# Altium project KitKTS.PrjPcb (part 1 of 3)
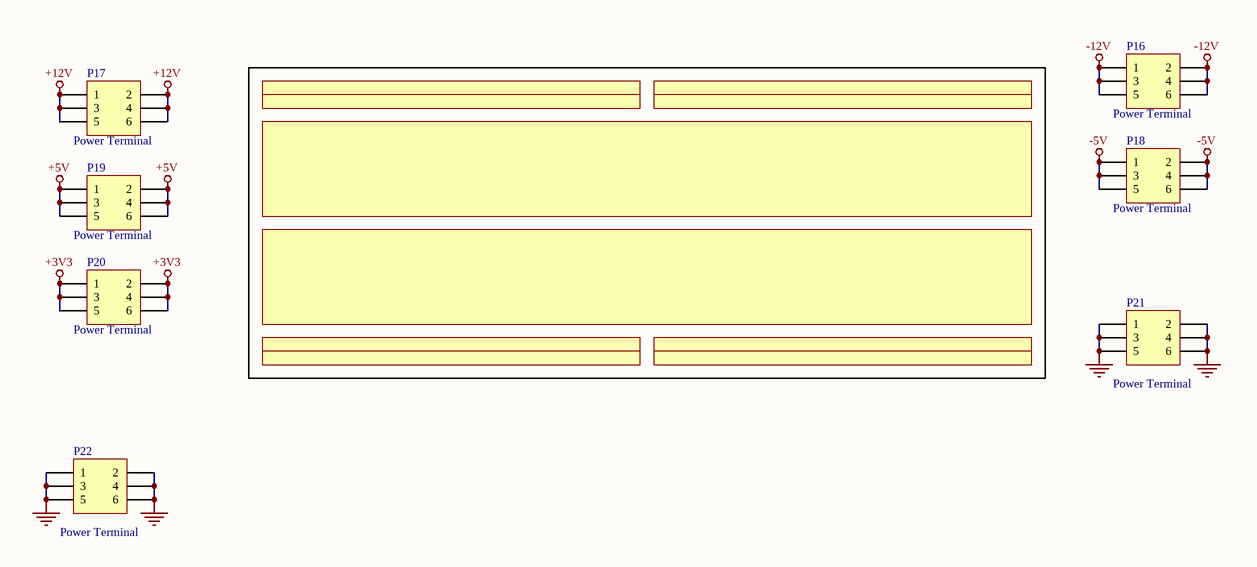
[diagram p0: 01-Breadboard.SchDoc]
26 sheets, 688 parts. Net scope: global (net labels, ports and power ports of the same name join across sheets).
Board file: mach PCB.PcbDoc
Sheets:
  01-Breadboard.SchDoc
  02-PowerSupply.SchDoc
  03-PulseGenerator.SchDoc
  04-LogicAND.SchDoc
  04-ANDStatusLed.SchDoc
  05-LogicOR.SchDoc
  05-ORStatusLed.SchDoc
  06-LogicNOT.SchDoc
  06-NOTStatusLed.SchDoc
  07-LogicXOR.SchDoc
  07-XORStatusLed.SchDoc
  08-LogicNAND.SchDoc
  08-NANDStatusLed.SchDoc
  09-LogicNOR.SchDoc
  09-NORStatusLed.SchDoc
  10-Buffer.SchDoc
  11-DFlipFlop.SchDoc
  12-JKFlipFlop.SchDoc
  13-Counter74LS90.SchDoc
  14-Counter74LS192.SchDoc
  15-DistanceSRF05.SchDoc
  16-BitSW.SchDoc
  16-BitSWStatusLed.SchDoc
  17-Led.SchDoc
  18-Led7.SchDoc
  19-CPLD.SchDoc

## Sheet 01-Breadboard.SchDoc
size A4

### Parts
P16  value Power Terminal  [HDR2X3]  (hidden comment: Header 3X2)
P17  value Power Terminal  [HDR2X3]  (hidden comment: Header 3X2)
P18  value Power Terminal  [HDR2X3]  (hidden comment: Header 3X2)
P19  value Power Terminal  [HDR2X3]  (hidden comment: Header 3X2)
P20  value Power Terminal  [HDR2X3]  (hidden comment: Header 3X2)
P21  value Power Terminal  [HDR2X3]  (hidden comment: Header 3X2)
P22  value Power Terminal  [HDR2X3]  (hidden comment: Header 3X2)

### Nets
+3V3: P20.1 P20.2 P20.3 P20.4 P20.5 P20.6
+5V: P19.1 P19.2 P19.3 P19.4 P19.5 P19.6
+12V: P17.1 P17.2 P17.3 P17.4 P17.5 P17.6
-5V: P18.1 P18.2 P18.3 P18.4 P18.5 P18.6
-12V: P16.1 P16.2 P16.3 P16.4 P16.5 P16.6
GND: P21.1 P21.2 P21.3 P21.4 P21.5 P21.6 P22.1 P22.2 P22.3 P22.4 P22.5 P22.6

### Library data of the parts
P16-P22 = Header 3X2: Header, 3-Pin, Dual row; LatestRevisionDate: 17-Jul-2002; LatestRevisionNote: Re-released for DXP Platform.

## Sheet 02-PowerSupply.SchDoc
size A4
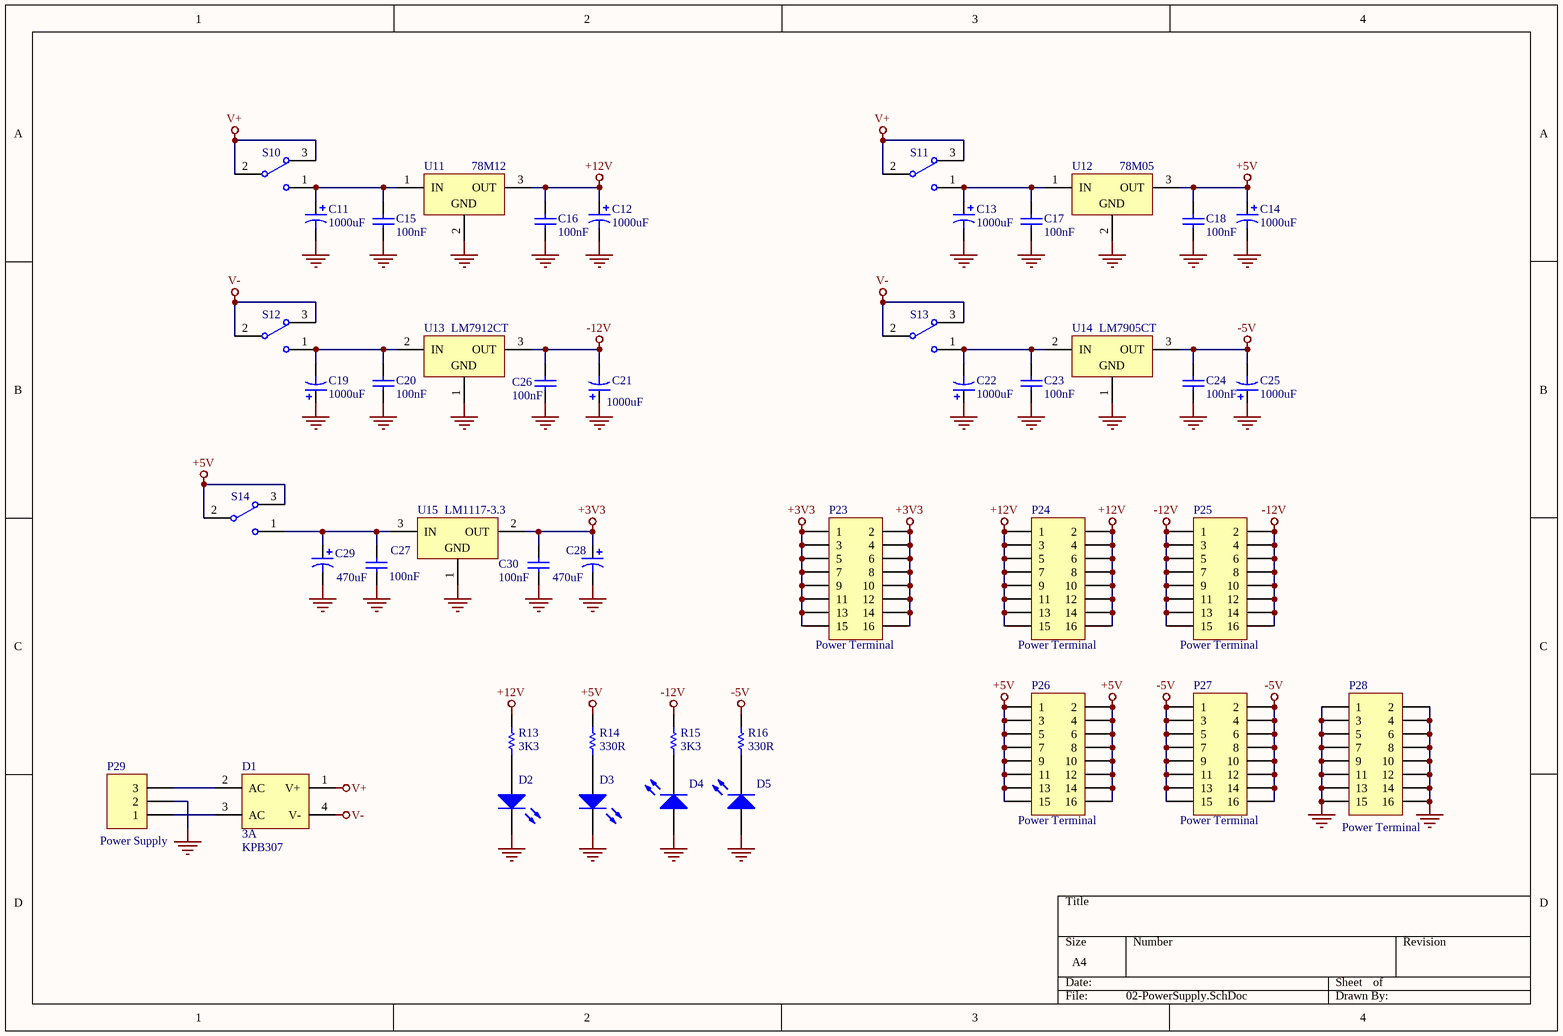
[diagram p1: 02-PowerSupply.SchDoc]

### Parts
C11  value 1000uF  [C-ALU-10x10mm]  (hidden comment: 1000uF/25V)
C12  value 1000uF  [C-ALU-10x10mm]  (hidden comment: 1000uF/25V)
C13  value 1000uF  [C-ALU-10x10mm]  (hidden comment: 1000uF/25V)
C14  value 1000uF  [C-ALU-10x10mm]  (hidden comment: 1000uF/25V)
C15  value 100nF  [C-0805]  (hidden comment: 104)
C16  value 100nF  [C-0805]  (hidden comment: 104)
C17  value 100nF  [C-0805]  (hidden comment: 104)
C18  value 100nF  [C-0805]  (hidden comment: 104)
C19  value 1000uF  [C-ALU-10x10mm]  (hidden comment: 1000uF/25V)
C20  value 100nF  [C-0805]  (hidden comment: 104)
C21  value 1000uF  [C-ALU-10x10mm]  (hidden comment: 1000uF/25V)
C22  value 1000uF  [C-ALU-10x10mm]  (hidden comment: 1000uF/25V)
C23  value 100nF  [C-0805]  (hidden comment: 104)
C24  value 100nF  [C-0805]  (hidden comment: 104)
C25  value 1000uF  [C-ALU-10x10mm]  (hidden comment: 1000uF/25V)
C26  value 100nF  [C-0805]  (hidden comment: 104)
C27  value 100nF  [C-0805]  (hidden comment: 104)
C28  value 470uF  [C-ALU-10x10mm]  (hidden comment: 470uF/16V)
C29  value 470uF  [C-ALU-10x10mm]  (hidden comment: 470uF/16V)
C30  value 100nF  [C-0805]  (hidden comment: 104)
D1  KPB307  value 3A  [D-DB-3A]
D2  LED  [LED-3528]  (value not drawn)
D3  LED  [LED-3528]  (value not drawn)
D4  LED  [LED-3528]  (value not drawn)
D5  LED  [LED-3528]  (value not drawn)
P23  value Power Terminal  [HDR2X8]  (hidden comment: Header 8X2)
P24  value Power Terminal  [HDR2X8]  (hidden comment: Header 8X2)
P25  value Power Terminal  [HDR2X8]  (hidden comment: Header 8X2)
P26  value Power Terminal  [HDR2X8]  (hidden comment: Header 8X2)
P27  value Power Terminal  [HDR2X8]  (hidden comment: Header 8X2)
P28  value Power Terminal  [HDR2X8]  (hidden comment: Header 8X2)
P29  value Power Supply  [HDR1X3]  (hidden comment: H3)
R13  value 3K3  [C-0805]  (hidden comment: 332)
R14  value 330R  [R-0805]  (hidden comment: 331)
R15  value 3K3  [R-0805]  (hidden comment: 332)
R16  value 330R  [R-0805]  (hidden comment: 331)
S10  SW-SPDT  [SW-DIP1SMD]  (value not drawn)
S11  SW-SPDT  [SW-DIP1SMD]  (value not drawn)
S12  SW-SPDT  [SW-DIP1SMD]  (value not drawn)
S13  SW-SPDT  [SW-DIP1SMD]  (value not drawn)
S14  SW-SPDT  [SW-DIP1SMD]  (value not drawn)
U11  78M12  [TO-220-2PC]
U12  78M05  [TO-220-2PC]
U13  LM7912CT  [TO-220-2PC]
U14  LM7905CT  [TO-220-2PC]
U15  LM1117-3.3  [TO-220-2PC]

### Nets
+3V3: C28.1 C30.2 P23.1 P23.2 P23.3 P23.4 P23.5 P23.6 P23.7 P23.8 P23.9 P23.10 P23.11 P23.12 P23.13 P23.14 P23.15 P23.16 U15.2(OUT)
+5V: C14.1 C18.2 P26.1 P26.2 P26.3 P26.4 P26.5 P26.6 P26.7 P26.8 P26.9 P26.10 P26.11 P26.12 P26.13 P26.14 P26.15 P26.16 R14.1 S14.2 S14.3 U12.3(OUT)
+12V: C12.1 C16.2 P24.1 P24.2 P24.3 P24.4 P24.5 P24.6 P24.7 P24.8 P24.9 P24.10 P24.11 P24.12 P24.13 P24.14 P24.15 P24.16 R13.1 U11.3(OUT)
-5V: C24.2 C25.2 P27.1 P27.2 P27.3 P27.4 P27.5 P27.6 P27.7 P27.8 P27.9 P27.10 P27.11 P27.12 P27.13 P27.14 P27.15 P27.16 R16.1 U14.3(OUT)
-12V: C21.2 C26.2 P25.1 P25.2 P25.3 P25.4 P25.5 P25.6 P25.7 P25.8 P25.9 P25.10 P25.11 P25.12 P25.13 P25.14 P25.15 P25.16 R15.1 U13.3(OUT)
GND: C11.2 C12.2 C13.2 C14.2 C15.1 C16.1 C17.1 C18.1 C19.1 C20.1 C21.1 C22.1 C23.1 C24.1 C25.1 C26.1 C27.1 C28.2 C29.2 C30.1 D2.2(K) D3.2(K) D4.1(A) D5.1(A) P28.1 P28.2 P28.3 P28.4 P28.5 P28.6 P28.7 P28.8 P28.9 P28.10 P28.11 P28.12 P28.13 P28.14 P28.15 P28.16 P29.2 U11.2(GND) U12.2(GND) U13.1(GND) U14.1(GND) U15.1(GND)
V+: D1.1(V+) S10.2 S10.3 S11.2 S11.3
V-: D1.4(V-) S12.2 S12.3 S13.2 S13.3
NetC11_1: C11.1 C15.2 S10.1 U11.1(IN)
NetC13_1: C13.1 C17.2 S11.1 U12.1(IN)
NetC19_2: C19.2 C20.2 S12.1 U13.2(IN)
NetC22_2: C22.2 C23.2 S13.1 U14.2(IN)
NetC27_2: C27.2 C29.1 S14.1 U15.3(IN)
NetD1_2: D1.2(AC) P29.3
NetD1_3: D1.3(AC) P29.1
NetD2_1: D2.1(A) R13.2
NetD3_1: D3.1(A) R14.2
NetD4_2: D4.2(K) R15.2
NetD5_2: D5.2(K) R16.2

### Library data of the parts
C11-C14 C19 C21 C22 C25 C28 C29 = Cap Pol1: Polarized Capacitor (Radial); Published: 8-Jun-2000; LatestRevisionDate: 17-Jul-2002; LatestRevisionNote: Re-released for DXP Platform.; PackageReference: RB7.6-15; Publisher: Altium Limited
C15-C18 C20 C23 C24 C26 C27 C30 = Cap: Capacitor; Manufacturer: Generic Components; Class: Passive; Published: 08/06/2000; Publisher: Altium Hobart Technology Centre; SubClass: Capacitor
D1 = Bridge2: Diode Bridge; Published: 24-Mar-1999; LatestRevisionDate: 17-Jul-2002; LatestRevisionNote: Re-released for DXP Platform.; PackageReference: D-46_6A
D2-D5 = LED0: Typical INFRARED GaAs LED; Published: 8-Jun-2000; LatestRevisionDate: 08-Jul-2005; LatestRevisionNote: Mech Layer 1 removed.; PackageReference: LED-0; Publisher: Altium Limited; Value: LED
P23-P28 = Header 8X2: Header, 8-Pin, Dual row; LatestRevisionDate: 17-Jul-2002; LatestRevisionNote: Re-released for DXP Platform.
P29 = Header 3: Header, 3-Pin; LatestRevisionDate: 17-Jul-2002; LatestRevisionNote: Re-released for DXP Platform.
R13-R16 = Res1: Resistor; Published: 8-Jun-2000; LatestRevisionDate: 17-Jul-2002; LatestRevisionNote: Re-released for DXP Platform.; PackageReference: AXIAL-0.3; Publisher: Altium Limited
S10-S14 = SW-SPDT: SPDT Subminiature Toggle Switch, Right Angle Mounting, Vertical Actuation; Published: 24-Mar-1999; LatestRevisionDate: 17-Dec-2003; LatestRevisionNote: Schematic revised, PCB Footprint replaced.; DatasheetVersion: 05-Dec-2000; PackageReference: TL36WW15050; Publisher: Altium Limited; PackageDescription: Switch; 4 Leads; ComponentLink1Description: Manufacturer Link; ComponentLink1URL: http://www.apem.com
U11 U12 = LM78M05CT: 3-Terminal Positive Voltage Regulators, 3-pin TO-220; Manufacturer: National Semiconductor; PackageTopMarking: NSUZXYTTE#*LM341T-5.0*LM78M05CT; PowerWise: N; CompType: LDO IC; Published: 4-Dec-2008; DatasheetVersion: Aug-2005; PackageVersion: revL, Jan-1992; PackageReference: T03B; Publisher: Altium Limited; PackageDescription: TO-220, Molded, 3 Lead, Straight; Supplier 1: Farnell; PartNumber: LM78M05CT; RoHS: N; PinCount: 3; ComponentLink1Description: LM78M05 Datasheet; ComponentLink1URL: http://www.national.com/ds/LM/LM78M05.pdf; ComponentLink2Description: LM78M05 Web Page; ComponentLink2URL: http://www.national.com/pf/LM/LM78M05.html; ComponentLink3Description: T03B Package Page; ComponentLink3URL: http://www.national.com/packaging/folders/t03b.html
  U11: Value: 78M12
  U12: Value: 78M05
U13 U14 = LM79M12CT: 3-Terminal Negative Regulators, 3-pin TO-220; Manufacturer: National Semiconductor; PackageTopMarking: NSUZXYTTE#*LM79M*12CT; PowerWise: N; CompType: LDO IC; Published: 4-Dec-2008; DatasheetVersion: Sep-2001; PackageVersion: revL, Jan-1992; PackageReference: T03B; Publisher: Altium Limited; PackageDescription: TO-220, Molded, 3 Lead, Straight; Supplier 1: Farnell; PartNumber: LM79M12CT; RoHS: N; PinCount: 3; ComponentLink1Description: LM79M12 Datasheet; ComponentLink1URL: http://www.national.com/ds/LM/LM79M12.pdf; ComponentLink2Description: LM79M12 Web Page; ComponentLink2URL: http://www.national.com/pf/LM/LM79M12.html; ComponentLink3Description: T03B Package Page; ComponentLink3URL: http://www.national.com/packaging/folders/t03b.html
  U13: Value: LM7912CT
  U14: Value: LM7905CT
U15 = LM1117IDTX-3.3: 800mA Low-Dropout Linear Regulator, 3-pin TO-252; Manufacturer: National Semiconductor; PackageTopMarking: NSUZXYTT*LM1117*IDT-3.3; PowerWise: N; CompType: LDO IC; Published: 1-Mar-2010; DatasheetVersion: Apr-2006; PackageVersion: revD, Feb-2009; PackageReference: TD03B; Publisher: Altium Limited; PackageDescription: TO252, Molded, Jedec, 6.8 x 6.10 x 2.30mm Body, 3 Lead, 2.28mm Pitch, Surface Mount; PartNumber: LM1117IDTX-3.3; Value: LM1117-3.3; PinCount: 3; Code_JEDEC: TO-252-AA; ComponentLink1Description: LM1117 Datasheet; ComponentLink1URL: http://www.national.com/ds/LM/LM1117.pdf; ComponentLink2Description: LM1117 Web Page; ComponentLink2URL: http://www.national.com/pf/LM/LM1117.html; ComponentLink3Description: TD03B Package Page; ComponentLink3URL: http://www.national.com/packaging/folders/td03b.html

## Sheet 03-PulseGenerator.SchDoc
size A4
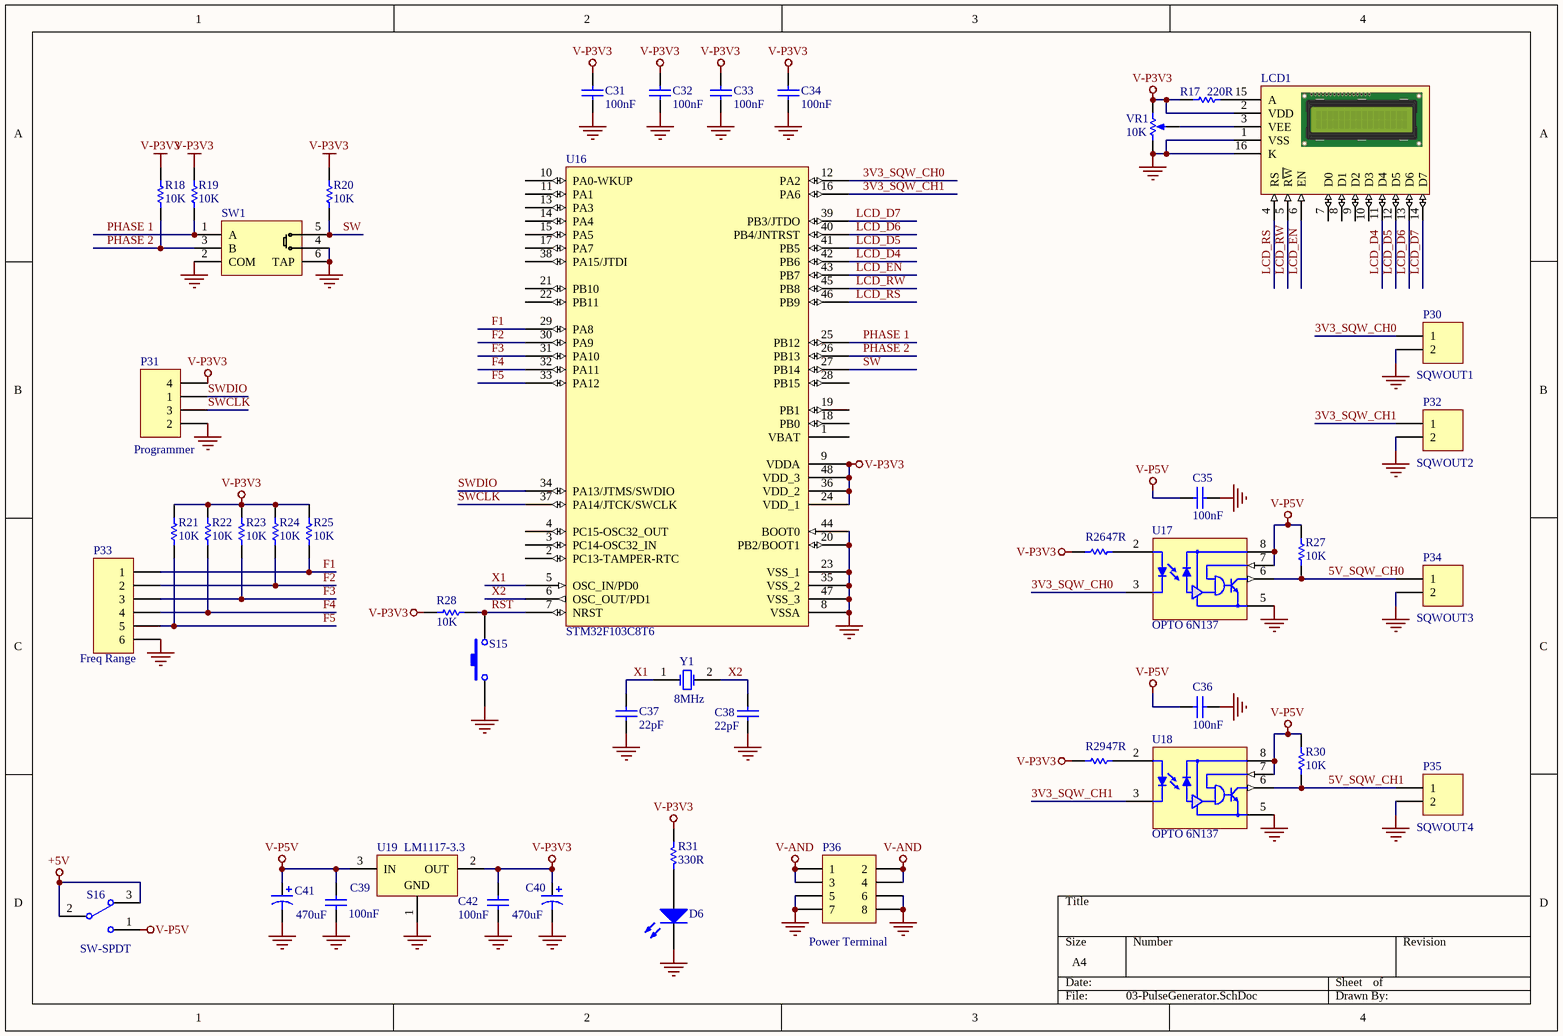
[diagram p2: 03-PulseGenerator.SchDoc]

### Parts
C31  value 100nF  [c-0805]  (hidden comment: 104)
C32  value 100nF  [c-0805]  (hidden comment: 104)
C33  value 100nF  [c-0805]  (hidden comment: 104)
C34  value 100nF  [c-0805]  (hidden comment: 104)
C35  value 100nF  [c-0805]  (hidden comment: 104)
C36  value 100nF  [c-0805]  (hidden comment: 104)
C37  value 22pF  [c-0805]  (hidden comment: 22)
C38  value 22pF  [c-0805]  (hidden comment: 22)
C39  value 100nF  [c-0805]  (hidden comment: 104)
C40  value 470uF  [C-ALU-10x10mm]  (hidden comment: 470uF/16V)
C41  value 470uF  [C-ALU-10x10mm]  (hidden comment: 470uF/16V)
C42  value 100nF  [c-0805]  (hidden comment: 104)
D6  LED  [LED-3528]  (value not drawn)
LCD1  LCD1602  [LCD-1602A]  (value not drawn)
P30  value SQWOUT1  [hed2]  (hidden comment: KF301)
P31  value Programmer  [HDR1X4]  (hidden comment: H4)
P32  value SQWOUT2  [hed2]  (hidden comment: KF301)
P33  value Freq Range  [HDR1X6]  (hidden comment: SW-5Way)
P34  value SQWOUT3  [hed2]  (hidden comment: KF301)
P35  value SQWOUT4  [hed2]  (hidden comment: KF301)
P36  Publisher: Power Terminal  [HDR2X4]  (hidden comment: Header 4X2)
R17  220R  [r-0805]
R18  value 10K  [r-0805]  (hidden comment: Res1)
R19  value 10K  [r-0805]  (hidden comment: Res1)
R20  value 10K  [r-0805]  (hidden comment: Res1)
R21  value 10K  [r-0805]  (hidden comment: Res1)
R22  value 10K  [r-0805]  (hidden comment: Res1)
R23  value 10K  [r-0805]  (hidden comment: Res1)
R24  value 10K  [r-0805]  (hidden comment: Res1)
R25  value 10K  [r-0805]  (hidden comment: Res1)
R26  47R  [r-0805]
R27  value 10K  [r-0805]  (hidden comment: Res1)
R28  value 10K  [r-0805]  (hidden comment: Res1)
R29  47R  [r-0805]
R30  value 10K  [r-0805]  (hidden comment: Res1)
R31  value 330R  [r-0805]  (hidden comment: 331)
S15  SW-S6  [sw2]  (value not drawn)
S16  SW-SPDT  [SW-DIP1SMD]
SW1  EC11  [SW-ENCODER]  (value not drawn)
U16  STM32F103C8T6  [LQFP-48]
U17  OPTO 6N137  [DIP8-300]
U18  OPTO 6N137  [DIP8-300]
U19  LM1117-3.3  [sot223]
VR1  10K  [VR1]
Y1  8MHz  [XTAL-RU49/4]

### Nets
+5V: S16.2 S16.3
GND: C31.1 C32.1 C33.1 C34.1 C35.1 C36.1 C37.1 C38.1 C39.1 C40.2 C41.2 C42.1 D6.2(K) LCD1.1(VSS) LCD1.16(K) P30.2 P31.2 P32.2 P33.6 P34.2 P35.2 P36.5 P36.6 P36.7 P36.8 S15.1 SW1.2(COM) SW1.4(BT+) SW1.6(TAP) U16.8(VSSA) U16.20(PB2/BOOT1) U16.23(VSS_1) U16.35(VSS_2) U16.44(BOOT0) U16.47(VSS_3) U17.5(GND) U18.5(GND) U19.1(GND) VR1.1(TOP)
V-AND: P36.1 P36.2 P36.3 P36.4
V-P3V3: C31.2 C32.2 C33.2 C34.2 C40.1 C42.2 LCD1.2(VDD) P31.4 R17.1 R18.2 R19.2 R20.2 R21.1 R22.1 R23.1 R24.1 R25.1 R26.1 R28.2 R29.1 R31.1 U16.9(VDDA) U16.24(VDD_1) U16.36(VDD_2) U16.48(VDD_3) U19.2(OUT) VR1.3(BOT)
V-P5V: C35.2 C36.2 C39.2 C41.1 R27.1 R30.1 S16.1 U17.7(EN) U17.8(VCC) U18.7(EN) U18.8(VCC) U19.3(IN)
3V3_SQW_CH0: P30.1 U16.12(PA2) U17.3(VF-)
3V3_SQW_CH1: P32.1 U16.16(PA6) U18.3(VF-)
5V_SQW_CH0: P34.1 R27.2 U17.6(Vo)
5V_SQW_CH1: P35.1 R30.2 U18.6(Vo)
F1: P33.1 R25.2 U16.29(PA8)
F2: P33.2 R24.2 U16.30(PA9)
F3: P33.3 R23.2 U16.31(PA10)
F4: P33.4 R22.2 U16.32(PA11)
F5: P33.5 R21.2 U16.33(PA12)
LCD_D4: LCD1.11(D4) U16.42(PB6)
LCD_D5: LCD1.12(D5) U16.41(PB5)
LCD_D6: LCD1.13(D6) U16.40(PB4/JNTRST)
LCD_D7: LCD1.14(D7) U16.39(PB3/JTDO)
LCD_EN: LCD1.6(EN) U16.43(PB7)
LCD_RS: LCD1.4(RS) U16.46(PB9)
LCD_RW: LCD1.5(R~{W}) U16.45(PB8)
PHASE 1: R19.1 SW1.1(A) U16.25(PB12)
PHASE 2: R18.1 SW1.3(B) U16.26(PB13)
RST: R28.1 S15.2 U16.7(NRST)
SW: R20.1 SW1.5(BT-) U16.27(PB14)
SWCLK: P31.3 U16.37(PA14/JTCK/SWCLK)
SWDIO: P31.1 U16.34(PA13/JTMS/SWDIO)
X1: C37.2 U16.5(OSC_IN/PD0) Y1.1(OSC1)
X2: C38.2 U16.6(OSC_OUT/PD1) Y1.2(OSC2)
NetD6_1: D6.1(A) R31.2
NetLCD1_3: LCD1.3(VEE) VR1.2(TAP)
NetLCD1_15: LCD1.15(A) R17.2
NetR26_2: R26.2 U17.2(VF+)
NetR29_2: R29.2 U18.2(VF+)

Not connected (* = marked no-connect by the designer): LCD1 7(D0) 8(D1) 9(D2) 10(D3); U16 1(VBAT) 2(PC13-TAMPER-RTC) 3(PC14-OSC32_IN) 4(PC15-OSC32_OUT) 10(PA0-WKUP) 11(PA1) 13(PA3) 14(PA4) 15(PA5) 17(PA7) 18(PB0) 19(PB1) 21(PB10) 22(PB11) 28(PB15) 38(PA15/JTDI); U17 1(NC) 4(NC); U18 1(NC) 4(NC)

### Library data of the parts
C31-C38 = Cap: Capacitor; Published: 8-Jun-2000; LatestRevisionDate: 17-Jul-2002; LatestRevisionNote: Re-released for DXP Platform.; PackageReference: RAD-0.3; Publisher: Altium Limited; PackageDescription: Radial Cap, Thru-Hole; 2 Leads; 0.3 in Pin Spacing
C39 C42 = Cap: as C15 on sheet 02-PowerSupply; Published: 08/06/2000; Publisher: Altium Hobart Technology Centre; SubClass: Capacitor
C40 C41 = Cap Pol1: Polarized Capacitor (Radial); Published: 8-Jun-2000; LatestRevisionDate: 17-Jul-2002; LatestRevisionNote: Re-released for DXP Platform.; PackageReference: RB7.6-15; Publisher: Altium Limited
D6 = LED0: Typical INFRARED GaAs LED; Published: 8-Jun-2000; LatestRevisionDate: 08-Jul-2005; LatestRevisionNote: Mech Layer 1 removed.; PackageReference: LED-0; Publisher: Altium Limited; Value: LED
LCD1 = LCD1602: Liquid Crystal Display; Value: LCD1602
P30 P32 P34 P35 = Header 2: Header, 2-Pin; LatestRevisionDate: 17-Jul-2002; LatestRevisionNote: Re-released for DXP Platform.
P31 = Header 4: Header, 4-Pin; LatestRevisionDate: 17-Jul-2002; LatestRevisionNote: Re-released for DXP Platform.
P33 = Header 6: Header, 6-Pin; LatestRevisionDate: 17-Jul-2002; LatestRevisionNote: Re-released for DXP Platform.
P36 = Header 4X2: Header, 4-Pin, Dual row; LatestRevisionDate: 17-Jul-2002; LatestRevisionNote: Re-released for DXP Platform.
R17-R31 = Res1: Resistor; Published: 8-Jun-2000; LatestRevisionDate: 17-Jul-2002; LatestRevisionNote: Re-released for DXP Platform.; PackageReference: AXIAL-0.3; Publisher: Altium Limited
  R17: PackageDescription: Axial Device, Thru-Hole; 2 Leads; 0.3 in Pin Spacing; Value: 220R
  R26 R29: Value: 47R
S15 = SW-PB: Switch; Value: Reset; Published: 24-Mar-1999; LatestRevisionDate: 17-Jul-2002; LatestRevisionNote: Re-released for DXP Platform.; PackageReference: SPST-2; PackageDescription: Switch; 2 Leads
S16 = SW-SPDT: as S10 on sheet 02-PowerSupply; Published: 24-Mar-1999; LatestRevisionDate: 17-Dec-2003; LatestRevisionNote: Schematic revised, PCB Footprint replaced.; DatasheetVersion: 05-Dec-2000; PackageReference: TL36WW15050; Publisher: Altium Limited; PackageDescription: Switch; 4 Leads; ComponentLink1Description: Manufacturer Link; ComponentLink1URL: http://www.apem.com
SW1 = SW EC11: Rotary Encoder with Switch; Value: EC11
U16 = STM32F103C8T6: STM32 ARM-based 32-bit MCU with 64 Kbytes Flash, 48-pin LQFP, Industrial Temperature; Published: 30-May-2008; DatasheetVersion: rev6, Mar-2008; PackageVersion: Mar-2008; PackageReference: LQFP48; Publisher: Altium Limited; PackageDescription: 48-Pin Low-Profile Quad Flat Pack, 7 x 7 mm Body, 0.5 mm Pitch (LQFP48); ComponentLink1Description: Manufacturer Link; ComponentLink1URL: www.st.com/stm32; ComponentLink2Description: Datasheet; ComponentLink2URL: http://www.st.com/stonline/products/literature/ds/13587.pdf
U17 U18 = OPTO 6N137: High Speed 10MBit/s Logic Gata Optocouplers; Value: 6N137
U19 = LM1117IDTX-3.3: as U15 on sheet 02-PowerSupply; Published: 1-Mar-2010; DatasheetVersion: Apr-2006; PackageVersion: revD, Feb-2009; PackageReference: TD03B; Publisher: Altium Limited; PackageDescription: TO252, Molded, Jedec, 6.8 x 6.10 x 2.30mm Body, 3 Lead, 2.28mm Pitch, Surface Mount; PartNumber: LM1117IDTX-3.3; Value: LM1117-3.3; PinCount: 3; Code_JEDEC: TO-252-AA; ComponentLink1Description: LM1117 Datasheet; ComponentLink1URL: http://www.national.com/ds/LM/LM1117.pdf; ComponentLink2Description: LM1117 Web Page; ComponentLink2URL: http://www.national.com/pf/LM/LM1117.html; ComponentLink3Description: TD03B Package Page; ComponentLink3URL: http://www.national.com/packaging/folders/td03b.html
VR1 = RPot: Potentiometer; Sim Note: Enter the Resistance value and the set point into parameter fields.; Set Position: 0.5; Published: 8-Jun-2000; LatestRevisionDate: 17-Jul-2002; LatestRevisionNote: Re-released for DXP Platform.; PackageReference: VR5; Publisher: Altium Limited; PackageDescription: Variable Resistor, Thru-Hole; 3 Leads; Value: 10K
Y1 = XTAL: Crystal Oscillator; Published: 8-Jun-2000; LatestRevisionDate: 17-Jul-2002; LatestRevisionNote: Re-released for DXP Platform.; PackageReference: R38; Value: 8MHz; PackageDescription: Crystal, Thru-Hole; 2 Leads; Body 3.1 x 8.2 mm (Dia.xH)

## Sheet 04-LogicAND.SchDoc
size A4
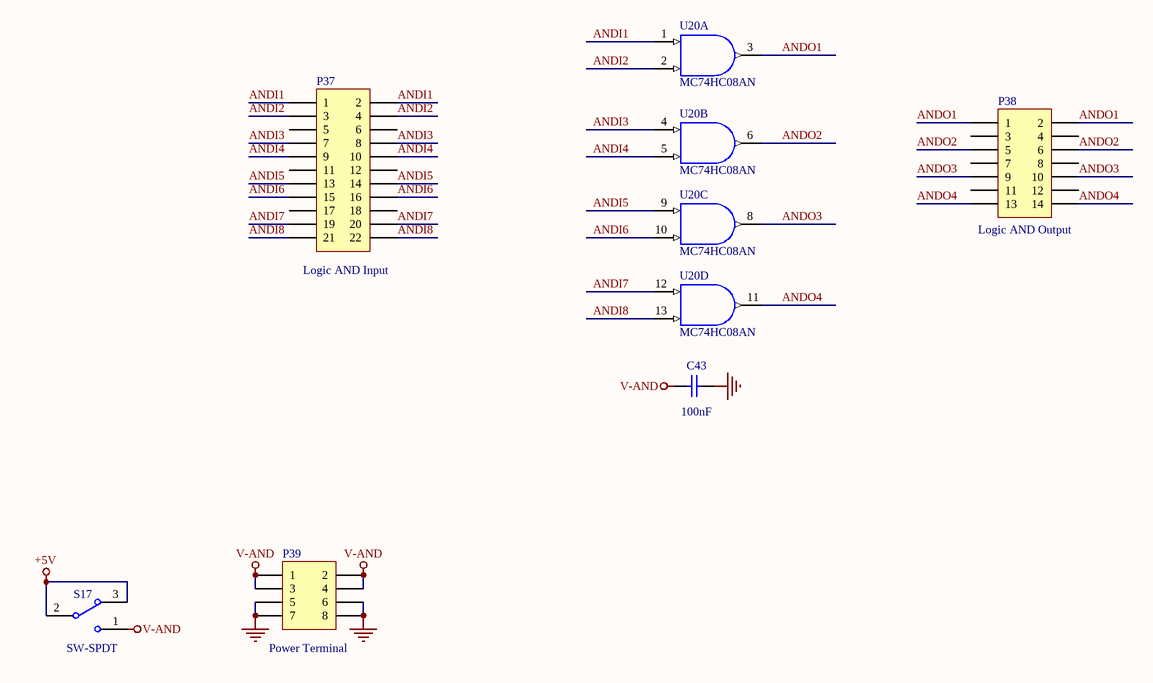
[diagram p3: 04-LogicAND.SchDoc]

### Parts
C43  value 100nF  [C-0805]  (hidden comment: 104)
P37  value Logic AND Input  [HDR2X11]  (hidden comment: Header 11X2)
P38  value Logic AND Output  [HDR2X7]  (hidden comment: H7X2)
P39  Publisher: Power Terminal  [HDR2X4]  (hidden comment: Header 4X2)
S17  SW-SPDT  [SW-DIP1SMD]
U20  MC74HC08AN  [SK-DIP14-300]  (parts A,B,C,D of 4)

### Nets
+5V: S17.2 S17.3
GND: C43.2 P39.5 P39.6 P39.7 P39.8 U20.7(GND)
V-AND: C43.1 P39.1 P39.2 P39.3 P39.4 S17.1
VDD: U20.14(V-AND)
ANDI1: P37.1 P37.2 U20.1(A)
ANDI2: P37.3 P37.4 U20.2(B)
ANDI3: P37.7 P37.8 U20.4(A)
ANDI4: P37.9 P37.10 U20.5(B)
ANDI5: P37.13 P37.14 U20.9(A)
ANDI6: P37.15 P37.16 U20.10(B)
ANDI7: P37.19 P37.20 U20.12(A)
ANDI8: P37.21 P37.22 U20.13(B)
ANDO1: P38.1 P38.2 U20.3(Y)
ANDO2: P38.5 P38.6 U20.6(Y)
ANDO3: P38.9 P38.10 U20.8(Y)
ANDO4: P38.13 P38.14 U20.11(Y)

Not connected (* = marked no-connect by the designer): P37 5 6 11 12 17 18; P38 3 4 7 8 11 12

### Library data of the parts
C43 = Cap: Capacitor; Published: 8-Jun-2000; LatestRevisionDate: 17-Jul-2002; LatestRevisionNote: Re-released for DXP Platform.; PackageReference: RAD-0.3; Publisher: Altium Limited; PackageDescription: Radial Cap, Thru-Hole; 2 Leads; 0.3 in Pin Spacing
P37 = Header 11X2: Header, 11-Pin, Dual row; LatestRevisionDate: 17-Jul-2002; LatestRevisionNote: Re-released for DXP Platform.
P38 = Header 7X2: Header, 7-Pin, Dual row; LatestRevisionDate: 17-Jul-2002; LatestRevisionNote: Re-released for DXP Platform.
P39 = Header 4X2: Header, 4-Pin, Dual row; LatestRevisionDate: 17-Jul-2002; LatestRevisionNote: Re-released for DXP Platform.
S17 = SW-SPDT: as S10 on sheet 02-PowerSupply; Published: 24-Mar-1999; LatestRevisionDate: 17-Dec-2003; LatestRevisionNote: Schematic revised, PCB Footprint replaced.; DatasheetVersion: 05-Dec-2000; PackageReference: TL36WW15050; Publisher: Altium Limited; PackageDescription: Switch; 4 Leads; ComponentLink1Description: Manufacturer Link; ComponentLink1URL: http://www.apem.com
U20 = MC74HC08AN: Quad 2-Input AND Gate; Published: 17-Jul-2002; LatestRevisionDate: 06-Jun-2005; LatestRevisionNote: Stylized 3D Model Added; DatasheetVersion: 1989; PackageVersion: 1997; PackageReference: 646-06; Publisher: Altium Limited; PackageDescription: DIP; 14 Leads; Row Spacing 7.62 mm; Pitch 2.54 mm; ComponentLink1Description: Manufacturer Link; ComponentLink1URL: http://www.onsemi.com/site/products/parametrics/0,4446,247,00.html; ComponentLink2Description: Ibis Model; ComponentLink2URL: http://www.onsemi.com/pub/Collateral/MC54HC08AJ.IBS

## Sheet 04-ANDStatusLed.SchDoc
size A4
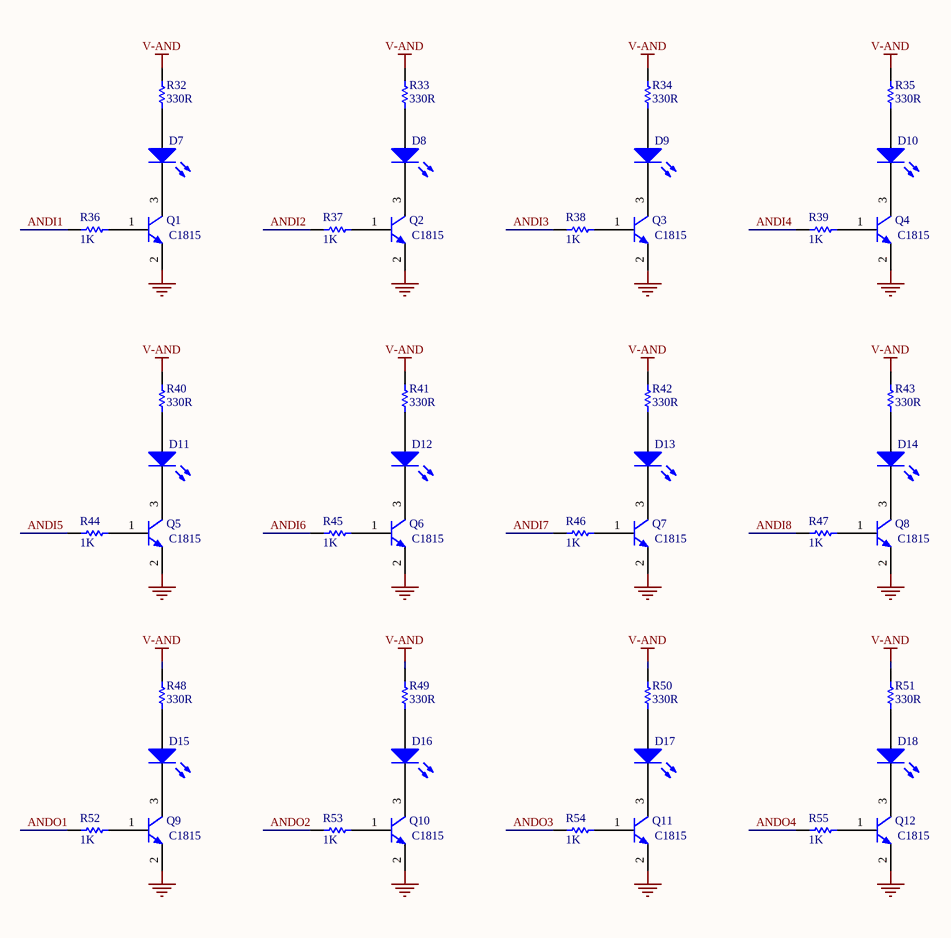
[diagram p4: 04-ANDStatusLed.SchDoc]

### Parts
D7  LED  [LED-3528]  (value not drawn)
D8  LED  [LED-3528]  (value not drawn)
D9  LED  [LED-3528]  (value not drawn)
D10  LED  [LED-3528]  (value not drawn)
D11  LED  [LED-3528]  (value not drawn)
D12  LED  [LED-3528]  (value not drawn)
D13  LED  [LED-3528]  (value not drawn)
D14  LED  [LED-3528]  (value not drawn)
D15  LED  [LED-3528]  (value not drawn)
D16  LED  [LED-3528]  (value not drawn)
D17  LED  [LED-3528]  (value not drawn)
D18  LED  [LED-3528]  (value not drawn)
Q1  value C1815  [SOT23-321]  (hidden comment: C1815-SMD)
Q2  value C1815  [SOT23-321]  (hidden comment: C1815-SMD)
Q3  value C1815  [SOT23-321]  (hidden comment: C1815-SMD)
Q4  value C1815  [SOT23-321]  (hidden comment: C1815-SMD)
Q5  value C1815  [SOT23-321]  (hidden comment: C1815-SMD)
Q6  value C1815  [SOT23-321]  (hidden comment: C1815-SMD)
Q7  value C1815  [SOT23-321]  (hidden comment: C1815-SMD)
Q8  value C1815  [SOT23-321]  (hidden comment: C1815-SMD)
Q9  value C1815  [SOT23-321]  (hidden comment: C1815-SMD)
Q10  value C1815  [SOT23-321]  (hidden comment: C1815-SMD)
Q11  value C1815  [SOT23-321]  (hidden comment: C1815-SMD)
Q12  value C1815  [SOT23-321]  (hidden comment: C1815-SMD)
R32  330R  [R-0805]
R33  330R  [R-0805]
R34  330R  [R-0805]
R35  330R  [R-0805]
R36  1K  [R-0805]
R37  1K  [R-0805]
R38  1K  [R-0805]
R39  1K  [R-0805]
R40  330R  [R-0805]
R41  330R  [R-0805]
R42  330R  [R-0805]
R43  330R  [R-0805]
R44  1K  [R-0805]
R45  1K  [R-0805]
R46  1K  [R-0805]
R47  1K  [R-0805]
R48  330R  [R-0805]
R49  330R  [R-0805]
R50  330R  [R-0805]
R51  330R  [R-0805]
R52  1K  [R-0805]
R53  1K  [R-0805]
R54  1K  [R-0805]
R55  1K  [R-0805]

### Nets
GND: Q1.2(E) Q2.2(E) Q3.2(E) Q4.2(E) Q5.2(E) Q6.2(E) Q7.2(E) Q8.2(E) Q9.2(E) Q10.2(E) Q11.2(E) Q12.2(E)
V-AND: R32.2 R33.2 R34.2 R35.2 R40.2 R41.2 R42.2 R43.2 R48.2 R49.2 R50.2 R51.2
ANDI1: R36.2
ANDI2: R37.2
ANDI3: R38.2
ANDI4: R39.2
ANDI5: R44.2
ANDI6: R45.2
ANDI7: R46.2
ANDI8: R47.2
ANDO1: R52.2
ANDO2: R53.2
ANDO3: R54.2
ANDO4: R55.2
NetD7_1: D7.1(A) R32.1
NetD7_2: D7.2(K) Q1.3(C)
NetD8_1: D8.1(A) R33.1
NetD8_2: D8.2(K) Q2.3(C)
NetD9_1: D9.1(A) R34.1
NetD9_2: D9.2(K) Q3.3(C)
NetD10_1: D10.1(A) R35.1
NetD10_2: D10.2(K) Q4.3(C)
NetD11_1: D11.1(A) R40.1
NetD11_2: D11.2(K) Q5.3(C)
NetD12_1: D12.1(A) R41.1
NetD12_2: D12.2(K) Q6.3(C)
NetD13_1: D13.1(A) R42.1
NetD13_2: D13.2(K) Q7.3(C)
NetD14_1: D14.1(A) R43.1
NetD14_2: D14.2(K) Q8.3(C)
NetD15_1: D15.1(A) R48.1
NetD15_2: D15.2(K) Q9.3(C)
NetD16_1: D16.1(A) R49.1
NetD16_2: D16.2(K) Q10.3(C)
NetD17_1: D17.1(A) R50.1
NetD17_2: D17.2(K) Q11.3(C)
NetD18_1: D18.1(A) R51.1
NetD18_2: D18.2(K) Q12.3(C)
NetQ1_1: Q1.1(B) R36.1
NetQ2_1: Q2.1(B) R37.1
NetQ3_1: Q3.1(B) R38.1
NetQ4_1: Q4.1(B) R39.1
NetQ5_1: Q5.1(B) R44.1
NetQ6_1: Q6.1(B) R45.1
NetQ7_1: Q7.1(B) R46.1
NetQ8_1: Q8.1(B) R47.1
NetQ9_1: Q9.1(B) R52.1
NetQ10_1: Q10.1(B) R53.1
NetQ11_1: Q11.1(B) R54.1
NetQ12_1: Q12.1(B) R55.1

### Library data of the parts
D7-D18 = LED2: Typical RED, GREEN, YELLOW, AMBER GaAs LED; Published: 8-Jun-2000; LatestRevisionDate: 17-Jul-2002; LatestRevisionNote: Re-released for DXP Platform.; PackageVersion: Feb-2002; PackageReference: 3.2X1.6X1.1; Publisher: Altium Limited; PackageDescription: SM LED; 2 Flat Leads
Q1-Q12 = NPN: NPN Bipolar Transistor; Published: 8-Jun-2000; LatestRevisionDate: 17-Jul-2002; LatestRevisionNote: Re-released for DXP Platform.; PackageReference: TO-226-AA; PackageDescription: TO, Flat Index; 3 In-Line, Axial Leads; Body Dia. 4.8mm; Leads 0.55 x 0.51 mm (max); Code_JEDEC: TO-226-AA
R32-R55 = Res1: Resistor; Published: 8-Jun-2000; LatestRevisionDate: 17-Jul-2002; LatestRevisionNote: Re-released for DXP Platform.; PackageReference: AXIAL-0.3; Publisher: Altium Limited; PackageDescription: Axial Device, Thru-Hole; 2 Leads; 0.3 in Pin Spacing
  R32-R35 R40-R43 R48-R51: Value: 330R
  R36-R39 R44-R47 R52-R55: Value: 1K

## Sheet 05-LogicOR.SchDoc
size A4
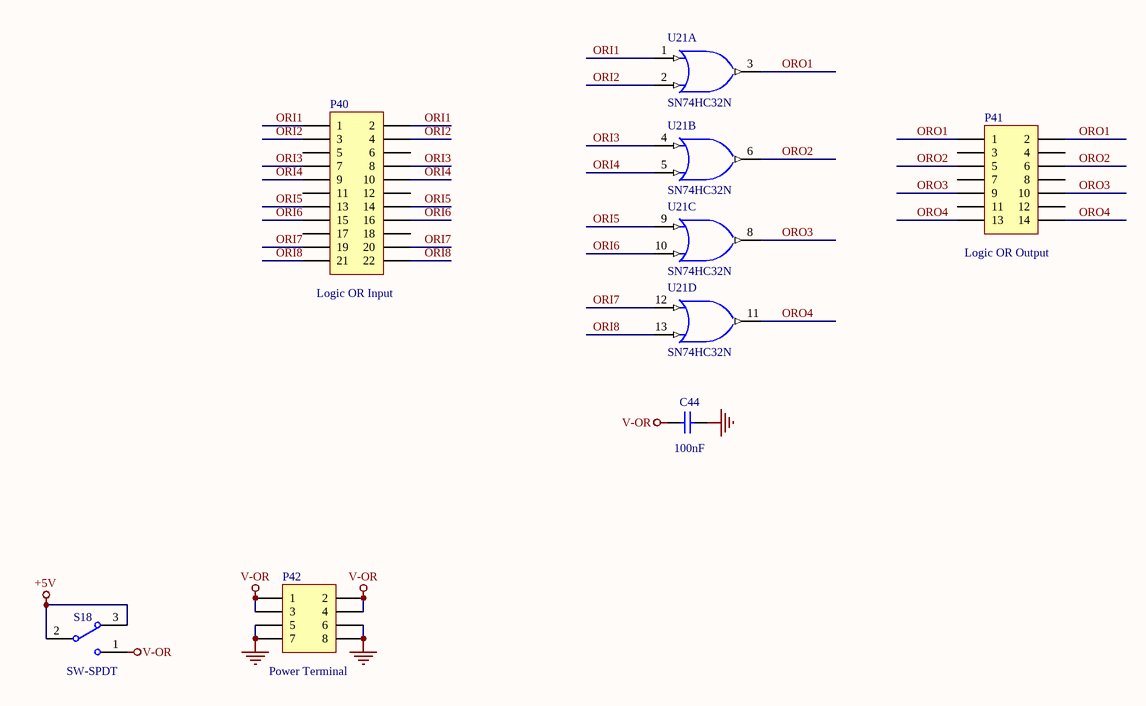
[diagram p5: 05-LogicOR.SchDoc]

### Parts
C44  value 100nF  [C-0805]  (hidden comment: 104)
P40  value Logic OR Input  [HDR2X11]  (hidden comment: Header 11X2)
P41  value Logic OR Output  [HDR2X7]  (hidden comment: H7X2)
P42  Publisher: Power Terminal  [HDR2X4]  (hidden comment: Header 4X2)
S18  SW-SPDT  [SW-DIP1SMD]
U21  SN74HC32N  [SK-DIP14-300]  (parts A,B,C,D of 4)

### Nets
+5V: S18.2 S18.3
GND: C44.2 P42.5 P42.6 P42.7 P42.8 U21.7(GND)
V-OR: C44.1 P42.1 P42.2 P42.3 P42.4 S18.1
VCC: U21.14(V-OR)
ORI1: P40.1 P40.2 U21.1(A)
ORI2: P40.3 P40.4 U21.2(B)
ORI3: P40.7 P40.8 U21.4(A)
ORI4: P40.9 P40.10 U21.5(B)
ORI5: P40.13 P40.14 U21.9(A)
ORI6: P40.15 P40.16 U21.10(B)
ORI7: P40.19 P40.20 U21.12(A)
ORI8: P40.21 P40.22 U21.13(B)
ORO1: P41.1 P41.2 U21.3(Y)
ORO2: P41.5 P41.6 U21.6(Y)
ORO3: P41.9 P41.10 U21.8(Y)
ORO4: P41.13 P41.14 U21.11(Y)

Not connected (* = marked no-connect by the designer): P40 5 6 11 12 17 18; P41 3 4 7 8 11 12

### Library data of the parts
C44 = Cap: Capacitor; Published: 8-Jun-2000; LatestRevisionDate: 17-Jul-2002; LatestRevisionNote: Re-released for DXP Platform.; PackageReference: RAD-0.3; Publisher: Altium Limited; PackageDescription: Radial Cap, Thru-Hole; 2 Leads; 0.3 in Pin Spacing
P40 = Header 11X2: Header, 11-Pin, Dual row; LatestRevisionDate: 17-Jul-2002; LatestRevisionNote: Re-released for DXP Platform.
P41 = Header 7X2: Header, 7-Pin, Dual row; LatestRevisionDate: 17-Jul-2002; LatestRevisionNote: Re-released for DXP Platform.
P42 = Header 4X2: Header, 4-Pin, Dual row; LatestRevisionDate: 17-Jul-2002; LatestRevisionNote: Re-released for DXP Platform.
S18 = SW-SPDT: as S10 on sheet 02-PowerSupply; Published: 24-Mar-1999; LatestRevisionDate: 17-Dec-2003; LatestRevisionNote: Schematic revised, PCB Footprint replaced.; DatasheetVersion: 05-Dec-2000; PackageReference: TL36WW15050; Publisher: Altium Limited; PackageDescription: Switch; 4 Leads; ComponentLink1Description: Manufacturer Link; ComponentLink1URL: http://www.apem.com
U21 = SN74HC32N: Quadruple 2-Input Positive-OR Gate; Published: 8-Jun-2000; LatestRevisionDate: 04-Mar-2005; LatestRevisionNote: Stylized 3D Model Added.; DatasheetVersion: May-1997; PackageVersion: Oct-1995; PackageReference: N014; Publisher: Altium Limited; PackageDescription: DIP; 14 Leads; Row Spacing 7.62 mm; Pitch 2.54 mm; ComponentLink1Description: Manufacturer Link; ComponentLink1URL: http://www.ti.com/; ComponentLink2Description: Datasheet; ComponentLink2URL: http://www-s.ti.com/sc/ds/sn74hc32.pdf

## Sheet 05-ORStatusLed.SchDoc
size A4
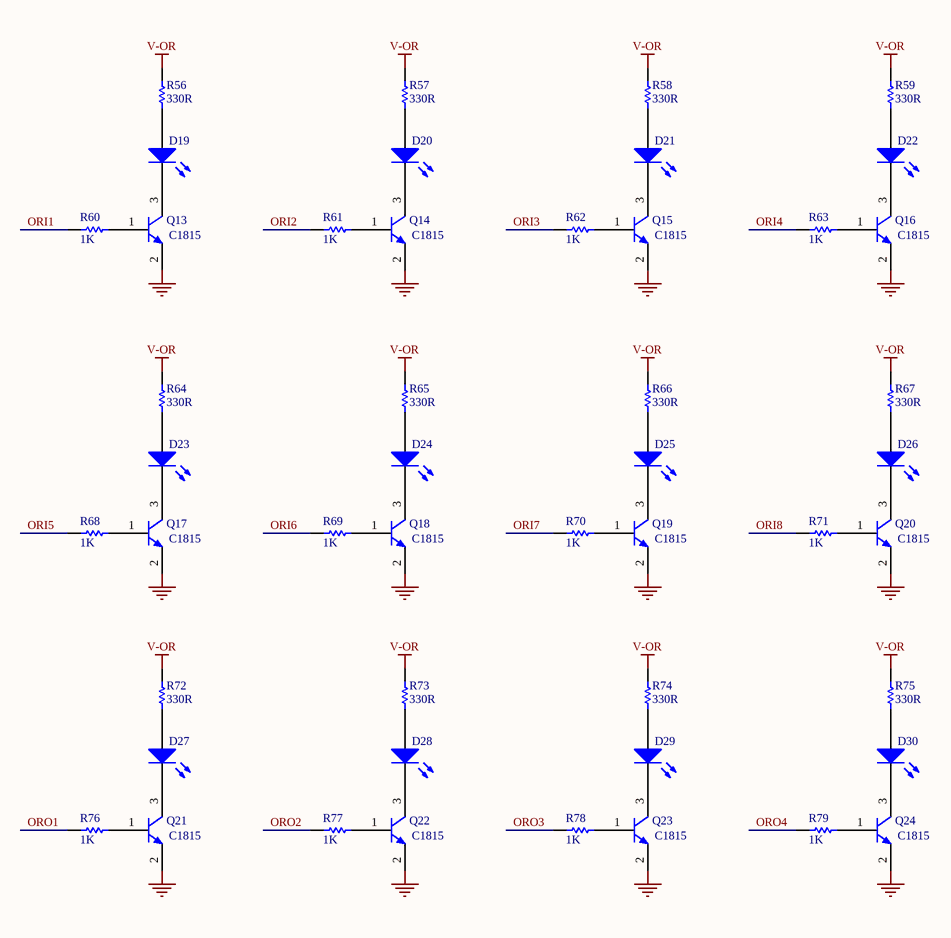
[diagram p6: 05-ORStatusLed.SchDoc]

### Parts
D19  LED  [LED-3528]  (value not drawn)
D20  LED  [LED-3528]  (value not drawn)
D21  LED  [LED-3528]  (value not drawn)
D22  LED  [LED-3528]  (value not drawn)
D23  LED  [LED-3528]  (value not drawn)
D24  LED  [LED-3528]  (value not drawn)
D25  LED  [LED-3528]  (value not drawn)
D26  LED  [LED-3528]  (value not drawn)
D27  LED  [LED-3528]  (value not drawn)
D28  LED  [LED-3528]  (value not drawn)
D29  LED  [LED-3528]  (value not drawn)
D30  LED  [LED-3528]  (value not drawn)
Q13  value C1815  [SOT23-321]  (hidden comment: C1815-SMD)
Q14  value C1815  [SOT23-321]  (hidden comment: C1815-SMD)
Q15  value C1815  [SOT23-321]  (hidden comment: C1815-SMD)
Q16  value C1815  [SOT23-321]  (hidden comment: C1815-SMD)
Q17  value C1815  [SOT23-321]  (hidden comment: C1815-SMD)
Q18  value C1815  [SOT23-321]  (hidden comment: C1815-SMD)
Q19  value C1815  [SOT23-321]  (hidden comment: C1815-SMD)
Q20  value C1815  [SOT23-321]  (hidden comment: C1815-SMD)
Q21  value C1815  [SOT23-321]  (hidden comment: C1815-SMD)
Q22  value C1815  [SOT23-321]  (hidden comment: C1815-SMD)
Q23  value C1815  [SOT23-321]  (hidden comment: C1815-SMD)
Q24  value C1815  [SOT23-321]  (hidden comment: C1815-SMD)
R56  330R  [R-0805]
R57  330R  [R-0805]
R58  330R  [R-0805]
R59  330R  [R-0805]
R60  1K  [R-0805]
R61  1K  [R-0805]
R62  1K  [R-0805]
R63  1K  [R-0805]
R64  330R  [R-0805]
R65  330R  [R-0805]
R66  330R  [R-0805]
R67  330R  [R-0805]
R68  1K  [R-0805]
R69  1K  [R-0805]
R70  1K  [R-0805]
R71  1K  [R-0805]
R72  330R  [R-0805]
R73  330R  [R-0805]
R74  330R  [R-0805]
R75  330R  [R-0805]
R76  1K  [R-0805]
R77  1K  [R-0805]
R78  1K  [R-0805]
R79  1K  [R-0805]

### Nets
GND: Q13.2(E) Q14.2(E) Q15.2(E) Q16.2(E) Q17.2(E) Q18.2(E) Q19.2(E) Q20.2(E) Q21.2(E) Q22.2(E) Q23.2(E) Q24.2(E)
V-OR: R56.2 R57.2 R58.2 R59.2 R64.2 R65.2 R66.2 R67.2 R72.2 R73.2 R74.2 R75.2
ORI1: R60.2
ORI2: R61.2
ORI3: R62.2
ORI4: R63.2
ORI5: R68.2
ORI6: R69.2
ORI7: R70.2
ORI8: R71.2
ORO1: R76.2
ORO2: R77.2
ORO3: R78.2
ORO4: R79.2
NetD19_1: D19.1(A) R56.1
NetD19_2: D19.2(K) Q13.3(C)
NetD20_1: D20.1(A) R57.1
NetD20_2: D20.2(K) Q14.3(C)
NetD21_1: D21.1(A) R58.1
NetD21_2: D21.2(K) Q15.3(C)
NetD22_1: D22.1(A) R59.1
NetD22_2: D22.2(K) Q16.3(C)
NetD23_1: D23.1(A) R64.1
NetD23_2: D23.2(K) Q17.3(C)
NetD24_1: D24.1(A) R65.1
NetD24_2: D24.2(K) Q18.3(C)
NetD25_1: D25.1(A) R66.1
NetD25_2: D25.2(K) Q19.3(C)
NetD26_1: D26.1(A) R67.1
NetD26_2: D26.2(K) Q20.3(C)
NetD27_1: D27.1(A) R72.1
NetD27_2: D27.2(K) Q21.3(C)
NetD28_1: D28.1(A) R73.1
NetD28_2: D28.2(K) Q22.3(C)
NetD29_1: D29.1(A) R74.1
NetD29_2: D29.2(K) Q23.3(C)
NetD30_1: D30.1(A) R75.1
NetD30_2: D30.2(K) Q24.3(C)
NetQ13_1: Q13.1(B) R60.1
NetQ14_1: Q14.1(B) R61.1
NetQ15_1: Q15.1(B) R62.1
NetQ16_1: Q16.1(B) R63.1
NetQ17_1: Q17.1(B) R68.1
NetQ18_1: Q18.1(B) R69.1
NetQ19_1: Q19.1(B) R70.1
NetQ20_1: Q20.1(B) R71.1
NetQ21_1: Q21.1(B) R76.1
NetQ22_1: Q22.1(B) R77.1
NetQ23_1: Q23.1(B) R78.1
NetQ24_1: Q24.1(B) R79.1

### Library data of the parts
D19-D30 = LED2: as D7 on sheet 04-ANDStatusLed; Published: 8-Jun-2000; LatestRevisionDate: 17-Jul-2002; LatestRevisionNote: Re-released for DXP Platform.; PackageVersion: Feb-2002; PackageReference: 3.2X1.6X1.1; Publisher: Altium Limited; PackageDescription: SM LED; 2 Flat Leads
Q13-Q24 = NPN: NPN Bipolar Transistor; Published: 8-Jun-2000; LatestRevisionDate: 17-Jul-2002; LatestRevisionNote: Re-released for DXP Platform.; PackageReference: TO-226-AA; PackageDescription: TO, Flat Index; 3 In-Line, Axial Leads; Body Dia. 4.8mm; Leads 0.55 x 0.51 mm (max); Code_JEDEC: TO-226-AA
R56-R79 = Res1: Resistor; Published: 8-Jun-2000; LatestRevisionDate: 17-Jul-2002; LatestRevisionNote: Re-released for DXP Platform.; PackageReference: AXIAL-0.3; Publisher: Altium Limited; PackageDescription: Axial Device, Thru-Hole; 2 Leads; 0.3 in Pin Spacing
  R56-R59 R64-R67 R72-R75: Value: 330R
  R60-R63 R68-R71 R76-R79: Value: 1K

## Sheet 06-LogicNOT.SchDoc
size A4
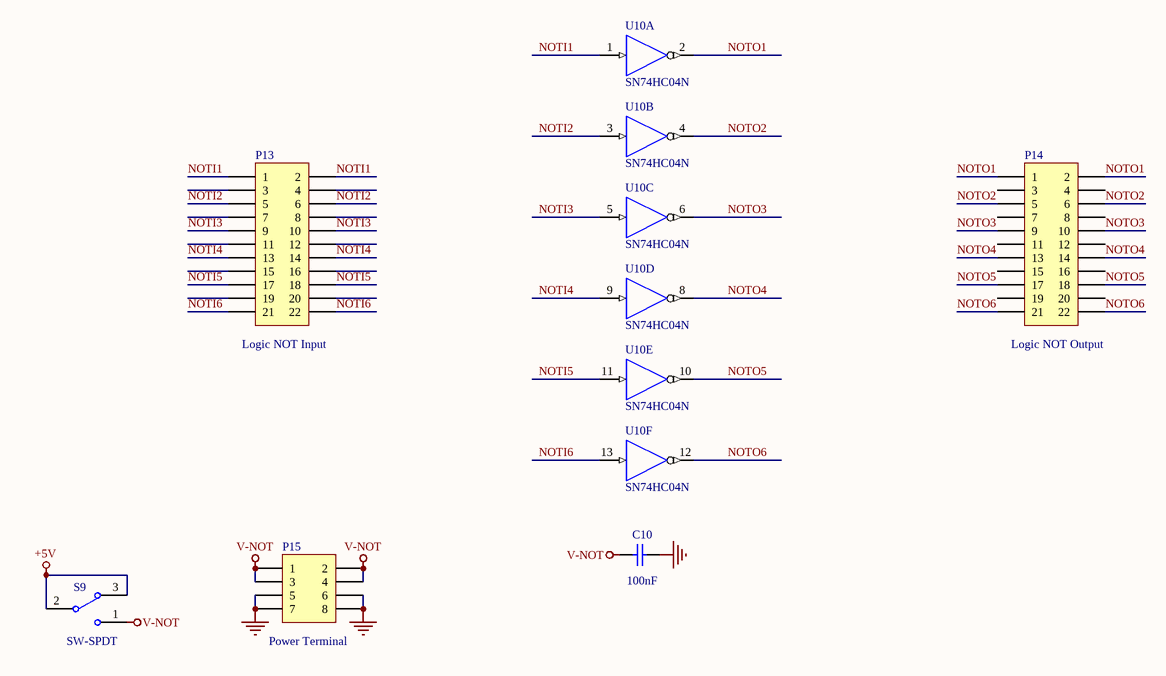
[diagram p7: 06-LogicNOT.SchDoc]

### Parts
C10  value 100nF  [C-0805]  (hidden comment: 104)
P13  value Logic NOT Input  [HDR2X11]  (hidden comment: Header 11X2)
P14  value Logic NOT Output  [HDR2X11]  (hidden comment: Header 11X2)
P15  Publisher: Power Terminal  [HDR2X4]  (hidden comment: Header 4X2)
S9  SW-SPDT  [SW-DIP1SMD]
U10  SN74HC04N  [SK-DIP14-300]  (parts A,B,C,D,E,F of 6)

### Nets
+5V: S9.2 S9.3
GND: C10.2 P15.5 P15.6 P15.7 P15.8 U10.7(GND)
V-NOT: C10.1 P15.1 P15.2 P15.3 P15.4 S9.1
VCC: U10.14(V-NOT)
NOTI1: P13.1 P13.2 U10.1(A)
NOTI2: P13.5 P13.6 U10.3(A)
NOTI3: P13.9 P13.10 U10.5(A)
NOTI4: P13.13 P13.14 U10.9(A)
NOTI5: P13.17 P13.18 U10.11(A)
NOTI6: P13.21 P13.22 U10.13(A)
NOTO1: P14.1 P14.2 U10.2(Y)
NOTO2: P14.5 P14.6 U10.4(Y)
NOTO3: P14.9 P14.10 U10.6(Y)
NOTO4: P14.13 P14.14 U10.8(Y)
NOTO5: P14.17 P14.18 U10.10(Y)
NOTO6: P14.21 P14.22 U10.12(Y)

Not connected (* = marked no-connect by the designer): P13 3 4 7 8 11 12 15 16 19 20; P14 3 4 7 8 11 12 15 16 19 20

### Library data of the parts
C10 = Cap: Capacitor; Published: 8-Jun-2000; LatestRevisionDate: 17-Jul-2002; LatestRevisionNote: Re-released for DXP Platform.; PackageReference: RAD-0.3; Publisher: Altium Limited; PackageDescription: Radial Cap, Thru-Hole; 2 Leads; 0.3 in Pin Spacing
P13 P14 = Header 11X2: Header, 11-Pin, Dual row; LatestRevisionDate: 17-Jul-2002; LatestRevisionNote: Re-released for DXP Platform.
P15 = Header 4X2: Header, 4-Pin, Dual row; LatestRevisionDate: 17-Jul-2002; LatestRevisionNote: Re-released for DXP Platform.
S9 = SW-SPDT: as S10 on sheet 02-PowerSupply; Published: 24-Mar-1999; LatestRevisionDate: 17-Dec-2003; LatestRevisionNote: Schematic revised, PCB Footprint replaced.; DatasheetVersion: 05-Dec-2000; PackageReference: TL36WW15050; Publisher: Altium Limited; PackageDescription: Switch; 4 Leads; ComponentLink1Description: Manufacturer Link; ComponentLink1URL: http://www.apem.com
U10 = SN74HC04N: Hex Inverter; Published: 8-Jun-2000; LatestRevisionDate: 04-Mar-2005; LatestRevisionNote: Stylized 3D Model Added.; DatasheetVersion: May-1997; PackageVersion: Oct-1995; PackageReference: N014; Publisher: Altium Limited; PackageDescription: DIP; 14 Leads; Row Spacing 7.62 mm; Pitch 2.54 mm; ComponentLink1Description: Manufacturer Link; ComponentLink1URL: http://www.ti.com/; ComponentLink2Description: Datasheet; ComponentLink2URL: http://www-s.ti.com/sc/ds/sn74hc04.pdf

## Sheet 06-NOTStatusLed.SchDoc
size A4
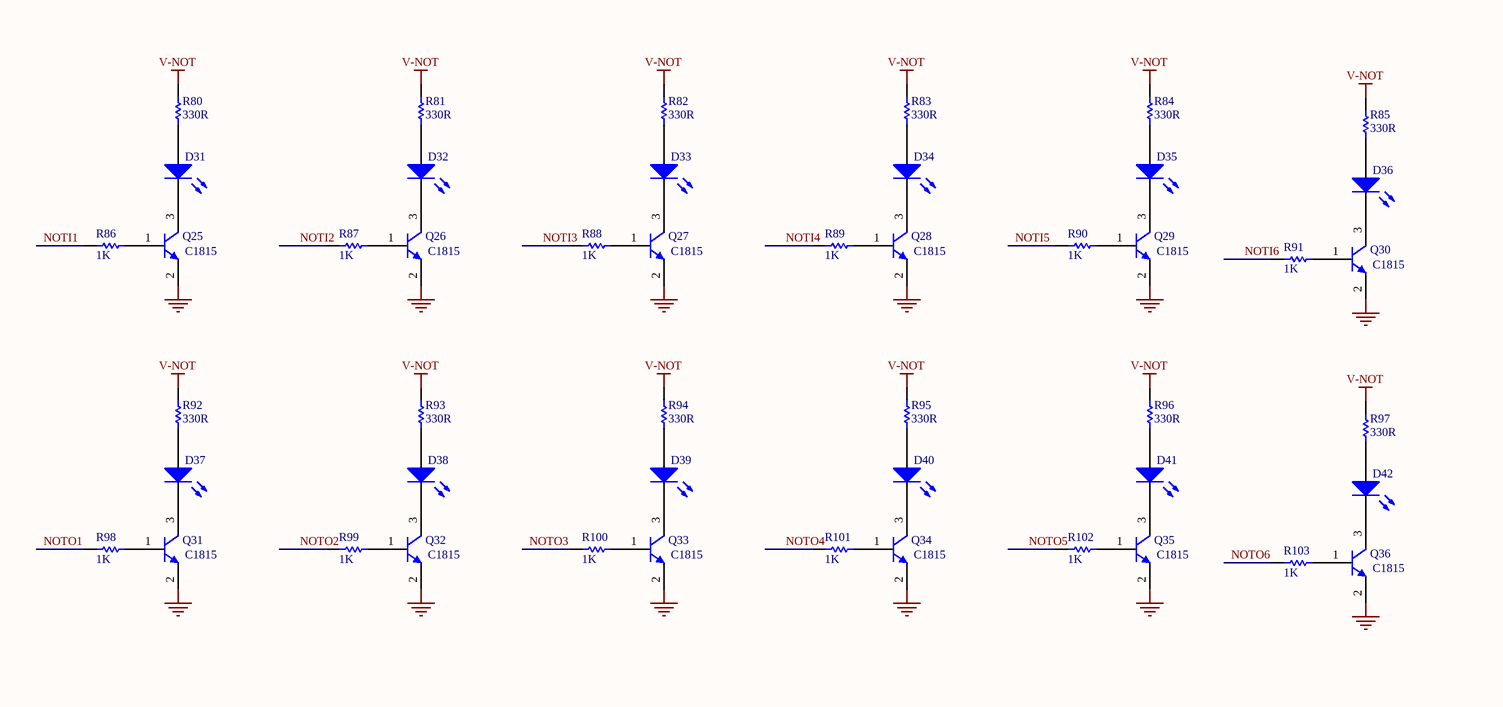
[diagram p8: 06-NOTStatusLed.SchDoc, left]
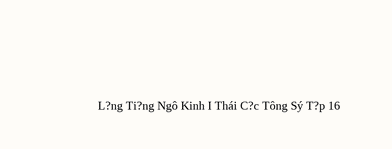
[diagram p9: 06-NOTStatusLed.SchDoc, right]

### Parts
D31  LED  [LED-3528]  (value not drawn)
D32  LED  [LED-3528]  (value not drawn)
D33  LED  [LED-3528]  (value not drawn)
D34  LED  [LED-3528]  (value not drawn)
D35  LED  [LED-3528]  (value not drawn)
D36  LED  [LED-3528]  (value not drawn)
D37  LED  [LED-3528]  (value not drawn)
D38  LED  [LED-3528]  (value not drawn)
D39  LED  [LED-3528]  (value not drawn)
D40  LED  [LED-3528]  (value not drawn)
D41  LED  [LED-3528]  (value not drawn)
D42  LED  [LED-3528]  (value not drawn)
Q25  value C1815  [SOT23-321]  (hidden comment: C1815-SMD)
Q26  value C1815  [SOT23-321]  (hidden comment: C1815-SMD)
Q27  value C1815  [SOT23-321]  (hidden comment: C1815-SMD)
Q28  value C1815  [SOT23-321]  (hidden comment: C1815-SMD)
Q29  value C1815  [SOT23-321]  (hidden comment: C1815-SMD)
Q30  value C1815  [SOT23-321]  (hidden comment: C1815-SMD)
Q31  value C1815  [SOT23-321]  (hidden comment: C1815-SMD)
Q32  value C1815  [SOT23-321]  (hidden comment: C1815-SMD)
Q33  value C1815  [SOT23-321]  (hidden comment: C1815-SMD)
Q34  value C1815  [SOT23-321]  (hidden comment: C1815-SMD)
Q35  value C1815  [SOT23-321]  (hidden comment: C1815-SMD)
Q36  value C1815  [SOT23-321]  (hidden comment: C1815-SMD)
R80  330R  [R-0805]
R81  330R  [R-0805]
R82  330R  [R-0805]
R83  330R  [R-0805]
R84  330R  [R-0805]
R85  330R  [R-0805]
R86  1K  [R-0805]
R87  1K  [R-0805]
R88  1K  [R-0805]
R89  1K  [R-0805]
R90  1K  [R-0805]
R91  1K  [R-0805]
R92  330R  [R-0805]
R93  330R  [R-0805]
R94  330R  [R-0805]
R95  330R  [R-0805]
R96  330R  [R-0805]
R97  330R  [R-0805]
R98  1K  [R-0805]
R99  1K  [R-0805]
R100  1K  [R-0805]
R101  1K  [R-0805]
R102  1K  [R-0805]
R103  1K  [R-0805]

### Nets
GND: Q25.2(E) Q26.2(E) Q27.2(E) Q28.2(E) Q29.2(E) Q30.2(E) Q31.2(E) Q32.2(E) Q33.2(E) Q34.2(E) Q35.2(E) Q36.2(E)
V-NOT: R80.2 R81.2 R82.2 R83.2 R84.2 R85.2 R92.2 R93.2 R94.2 R95.2 R96.2 R97.2
NOTI1: R86.2
NOTI2: R87.2
NOTI3: R88.2
NOTI4: R89.2
NOTI5: R90.2
NOTI6: R91.2
NOTO1: R98.2
NOTO2: R99.2
NOTO3: R100.2
NOTO4: R101.2
NOTO5: R102.2
NOTO6: R103.2
NetD31_1: D31.1(A) R80.1
NetD31_2: D31.2(K) Q25.3(C)
NetD32_1: D32.1(A) R81.1
NetD32_2: D32.2(K) Q26.3(C)
NetD33_1: D33.1(A) R82.1
NetD33_2: D33.2(K) Q27.3(C)
NetD34_1: D34.1(A) R83.1
NetD34_2: D34.2(K) Q28.3(C)
NetD35_1: D35.1(A) R84.1
NetD35_2: D35.2(K) Q29.3(C)
NetD36_1: D36.1(A) R85.1
NetD36_2: D36.2(K) Q30.3(C)
NetD37_1: D37.1(A) R92.1
NetD37_2: D37.2(K) Q31.3(C)
NetD38_1: D38.1(A) R93.1
NetD38_2: D38.2(K) Q32.3(C)
NetD39_1: D39.1(A) R94.1
NetD39_2: D39.2(K) Q33.3(C)
NetD40_1: D40.1(A) R95.1
NetD40_2: D40.2(K) Q34.3(C)
NetD41_1: D41.1(A) R96.1
NetD41_2: D41.2(K) Q35.3(C)
NetD42_1: D42.1(A) R97.1
NetD42_2: D42.2(K) Q36.3(C)
NetQ25_1: Q25.1(B) R86.1
NetQ26_1: Q26.1(B) R87.1
NetQ27_1: Q27.1(B) R88.1
NetQ28_1: Q28.1(B) R89.1
NetQ29_1: Q29.1(B) R90.1
NetQ30_1: Q30.1(B) R91.1
NetQ31_1: Q31.1(B) R98.1
NetQ32_1: Q32.1(B) R99.1
NetQ33_1: Q33.1(B) R100.1
NetQ34_1: Q34.1(B) R101.1
NetQ35_1: Q35.1(B) R102.1
NetQ36_1: Q36.1(B) R103.1

### Notes on the sheet
- L?ng Ti?ng Ngô Kinh I Thái C?c Tông Sý T?p 16

### Library data of the parts
D31-D42 = LED2: as D7 on sheet 04-ANDStatusLed; Published: 8-Jun-2000; LatestRevisionDate: 17-Jul-2002; LatestRevisionNote: Re-released for DXP Platform.; PackageVersion: Feb-2002; PackageReference: 3.2X1.6X1.1; Publisher: Altium Limited; PackageDescription: SM LED; 2 Flat Leads
Q25-Q36 = NPN: NPN Bipolar Transistor; Published: 8-Jun-2000; LatestRevisionDate: 17-Jul-2002; LatestRevisionNote: Re-released for DXP Platform.; PackageReference: TO-226-AA; PackageDescription: TO, Flat Index; 3 In-Line, Axial Leads; Body Dia. 4.8mm; Leads 0.55 x 0.51 mm (max); Code_JEDEC: TO-226-AA
R80-R103 = Res1: Resistor; Published: 8-Jun-2000; LatestRevisionDate: 17-Jul-2002; LatestRevisionNote: Re-released for DXP Platform.; PackageReference: AXIAL-0.3; Publisher: Altium Limited; PackageDescription: Axial Device, Thru-Hole; 2 Leads; 0.3 in Pin Spacing
  R80-R85 R92-R97: Value: 330R
  R86-R91 R98-R103: Value: 1K

## Sheet 07-LogicXOR.SchDoc
size A4
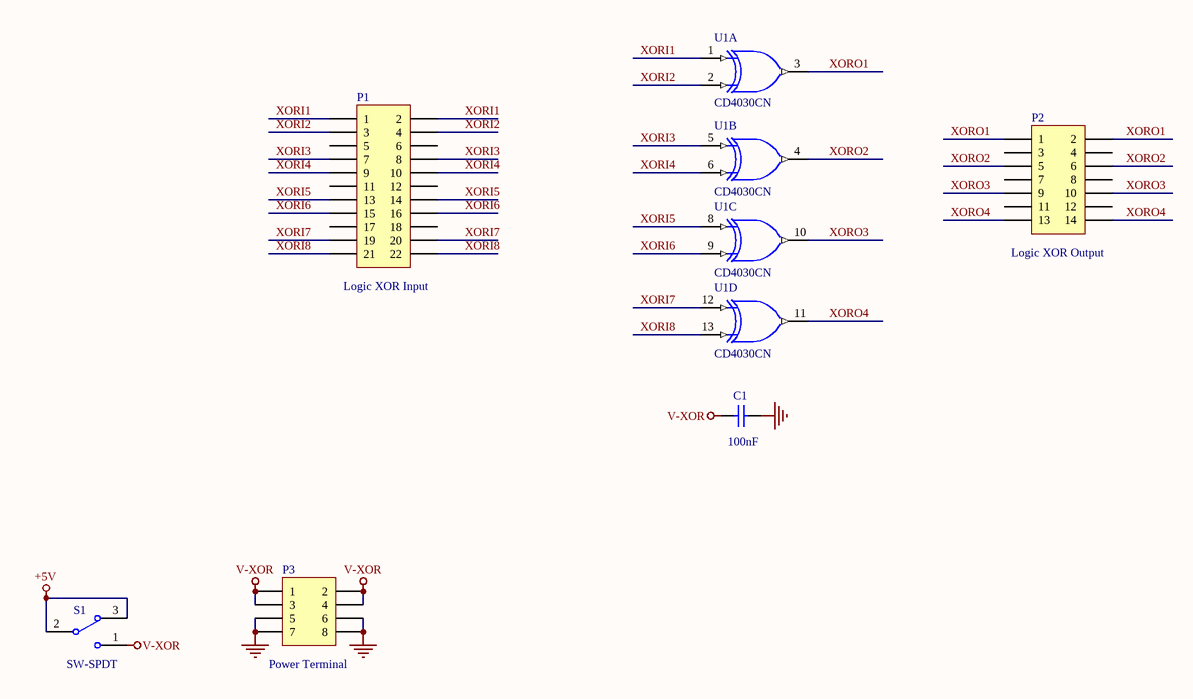
[diagram p10: 07-LogicXOR.SchDoc]

### Parts
C1  value 100nF  [C-0805]  (hidden comment: 104)
P1  value Logic XOR Input  [HDR2X11]  (hidden comment: Header 11X2)
P2  value Logic XOR Output  [HDR2X7]  (hidden comment: H7X2)
P3  Publisher: Power Terminal  [HDR2X4]  (hidden comment: Header 4X2)
S1  SW-SPDT  [SW-DIP1SMD]
U1  CD4030CN  [SK-DIP14-300]  (parts A,B,C,D of 4)

### Nets
+5V: S1.2 S1.3
GND: C1.2 P3.5 P3.6 P3.7 P3.8 U1.7(GND)
V-XOR: C1.1 P3.1 P3.2 P3.3 P3.4 S1.1
VDD: U1.14(V-XOR)
XORI1: P1.1 P1.2 U1.1(B)
XORI2: P1.3 P1.4 U1.2(A)
XORI3: P1.7 P1.8 U1.5(A)
XORI4: P1.9 P1.10 U1.6(B)
XORI5: P1.13 P1.14 U1.8(A)
XORI6: P1.15 P1.16 U1.9(B)
XORI7: P1.19 P1.20 U1.12(A)
XORI8: P1.21 P1.22 U1.13(B)
XORO1: P2.1 P2.2 U1.3(J)
XORO2: P2.5 P2.6 U1.4(J)
XORO3: P2.9 P2.10 U1.10(J)
XORO4: P2.13 P2.14 U1.11(J)

Not connected (* = marked no-connect by the designer): P1 5 6 11 12 17 18; P2 3 4 7 8 11 12

### Library data of the parts
C1 = Cap: Capacitor; Published: 8-Jun-2000; LatestRevisionDate: 17-Jul-2002; LatestRevisionNote: Re-released for DXP Platform.; PackageReference: RAD-0.3; Publisher: Altium Limited; PackageDescription: Radial Cap, Thru-Hole; 2 Leads; 0.3 in Pin Spacing
P1 = Header 11X2: Header, 11-Pin, Dual row; LatestRevisionDate: 17-Jul-2002; LatestRevisionNote: Re-released for DXP Platform.
P2 = Header 7X2: Header, 7-Pin, Dual row; LatestRevisionDate: 17-Jul-2002; LatestRevisionNote: Re-released for DXP Platform.
P3 = Header 4X2: Header, 4-Pin, Dual row; LatestRevisionDate: 17-Jul-2002; LatestRevisionNote: Re-released for DXP Platform.
S1 = SW-SPDT: as S10 on sheet 02-PowerSupply; Published: 24-Mar-1999; LatestRevisionDate: 17-Dec-2003; LatestRevisionNote: Schematic revised, PCB Footprint replaced.; DatasheetVersion: 05-Dec-2000; PackageReference: TL36WW15050; Publisher: Altium Limited; PackageDescription: Switch; 4 Leads; ComponentLink1Description: Manufacturer Link; ComponentLink1URL: http://www.apem.com
U1 = CD4030CN: Quad Exclusive OR Gate, 14-Pin PDIP; IC_Technology: C; Published: 17-Jul-2002; LatestRevisionDate: 29-May-2009; LatestRevisionNote: Component Body Added.; DatasheetVersion: Jan-1999; PackageVersion: 2000; PackageReference: N14A; Publisher: Altium Limited; PackageDescription: DIP, 14-Pin, Row Spacing 7.62 mm, Pitch 2.54 mm; ComponentLink1Description: Manufacturer Link; ComponentLink1URL: http://www.fairchildsemi.com/

## Sheet 07-XORStatusLed.SchDoc
size A4
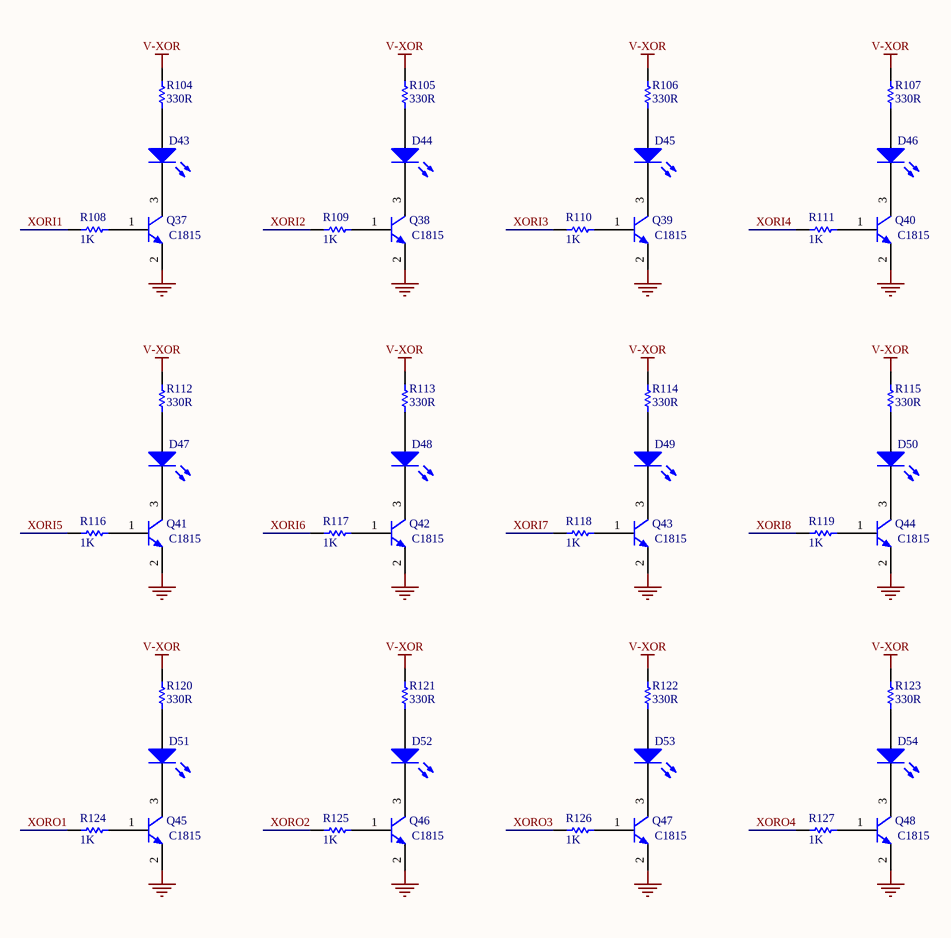
[diagram p11: 07-XORStatusLed.SchDoc]

### Parts
D43  LED  [LED-3528]  (value not drawn)
D44  LED  [LED-3528]  (value not drawn)
D45  LED  [LED-3528]  (value not drawn)
D46  LED  [LED-3528]  (value not drawn)
D47  LED  [LED-3528]  (value not drawn)
D48  LED  [LED-3528]  (value not drawn)
D49  LED  [LED-3528]  (value not drawn)
D50  LED  [LED-3528]  (value not drawn)
D51  LED  [LED-3528]  (value not drawn)
D52  LED  [LED-3528]  (value not drawn)
D53  LED  [LED-3528]  (value not drawn)
D54  LED  [LED-3528]  (value not drawn)
Q37  value C1815  [SOT23-321]  (hidden comment: C1815-SMD)
Q38  value C1815  [SOT23-321]  (hidden comment: C1815-SMD)
Q39  value C1815  [SOT23-321]  (hidden comment: C1815-SMD)
Q40  value C1815  [SOT23-321]  (hidden comment: C1815-SMD)
Q41  value C1815  [SOT23-321]  (hidden comment: C1815-SMD)
Q42  value C1815  [SOT23-321]  (hidden comment: C1815-SMD)
Q43  value C1815  [SOT23-321]  (hidden comment: C1815-SMD)
Q44  value C1815  [SOT23-321]  (hidden comment: C1815-SMD)
Q45  value C1815  [SOT23-321]  (hidden comment: C1815-SMD)
Q46  value C1815  [SOT23-321]  (hidden comment: C1815-SMD)
Q47  value C1815  [SOT23-321]  (hidden comment: C1815-SMD)
Q48  value C1815  [SOT23-321]  (hidden comment: C1815-SMD)
R104  330R  [R-0805]
R105  330R  [R-0805]
R106  330R  [R-0805]
R107  330R  [R-0805]
R108  1K  [R-0805]
R109  1K  [R-0805]
R110  1K  [R-0805]
R111  1K  [R-0805]
R112  330R  [R-0805]
R113  330R  [R-0805]
R114  330R  [R-0805]
R115  330R  [R-0805]
R116  1K  [R-0805]
R117  1K  [R-0805]
R118  1K  [R-0805]
R119  1K  [R-0805]
R120  330R  [R-0805]
R121  330R  [R-0805]
R122  330R  [R-0805]
R123  330R  [R-0805]
R124  1K  [R-0805]
R125  1K  [R-0805]
R126  1K  [R-0805]
R127  1K  [R-0805]

### Nets
GND: Q37.2(E) Q38.2(E) Q39.2(E) Q40.2(E) Q41.2(E) Q42.2(E) Q43.2(E) Q44.2(E) Q45.2(E) Q46.2(E) Q47.2(E) Q48.2(E)
V-XOR: R104.2 R105.2 R106.2 R107.2 R112.2 R113.2 R114.2 R115.2 R120.2 R121.2 R122.2 R123.2
XORI1: R108.2
XORI2: R109.2
XORI3: R110.2
XORI4: R111.2
XORI5: R116.2
XORI6: R117.2
XORI7: R118.2
XORI8: R119.2
XORO1: R124.2
XORO2: R125.2
XORO3: R126.2
XORO4: R127.2
NetD43_1: D43.1(A) R104.1
NetD43_2: D43.2(K) Q37.3(C)
NetD44_1: D44.1(A) R105.1
NetD44_2: D44.2(K) Q38.3(C)
NetD45_1: D45.1(A) R106.1
NetD45_2: D45.2(K) Q39.3(C)
NetD46_1: D46.1(A) R107.1
NetD46_2: D46.2(K) Q40.3(C)
NetD47_1: D47.1(A) R112.1
NetD47_2: D47.2(K) Q41.3(C)
NetD48_1: D48.1(A) R113.1
NetD48_2: D48.2(K) Q42.3(C)
NetD49_1: D49.1(A) R114.1
NetD49_2: D49.2(K) Q43.3(C)
NetD50_1: D50.1(A) R115.1
NetD50_2: D50.2(K) Q44.3(C)
NetD51_1: D51.1(A) R120.1
NetD51_2: D51.2(K) Q45.3(C)
NetD52_1: D52.1(A) R121.1
NetD52_2: D52.2(K) Q46.3(C)
NetD53_1: D53.1(A) R122.1
NetD53_2: D53.2(K) Q47.3(C)
NetD54_1: D54.1(A) R123.1
NetD54_2: D54.2(K) Q48.3(C)
NetQ37_1: Q37.1(B) R108.1
NetQ38_1: Q38.1(B) R109.1
NetQ39_1: Q39.1(B) R110.1
NetQ40_1: Q40.1(B) R111.1
NetQ41_1: Q41.1(B) R116.1
NetQ42_1: Q42.1(B) R117.1
NetQ43_1: Q43.1(B) R118.1
NetQ44_1: Q44.1(B) R119.1
NetQ45_1: Q45.1(B) R124.1
NetQ46_1: Q46.1(B) R125.1
NetQ47_1: Q47.1(B) R126.1
NetQ48_1: Q48.1(B) R127.1

### Library data of the parts
D43-D54 = LED2: as D7 on sheet 04-ANDStatusLed; Published: 8-Jun-2000; LatestRevisionDate: 17-Jul-2002; LatestRevisionNote: Re-released for DXP Platform.; PackageVersion: Feb-2002; PackageReference: 3.2X1.6X1.1; Publisher: Altium Limited; PackageDescription: SM LED; 2 Flat Leads
Q37-Q48 = NPN: NPN Bipolar Transistor; Published: 8-Jun-2000; LatestRevisionDate: 17-Jul-2002; LatestRevisionNote: Re-released for DXP Platform.; PackageReference: TO-226-AA; PackageDescription: TO, Flat Index; 3 In-Line, Axial Leads; Body Dia. 4.8mm; Leads 0.55 x 0.51 mm (max); Code_JEDEC: TO-226-AA
R104-R127 = Res1: Resistor; Published: 8-Jun-2000; LatestRevisionDate: 17-Jul-2002; LatestRevisionNote: Re-released for DXP Platform.; PackageReference: AXIAL-0.3; Publisher: Altium Limited; PackageDescription: Axial Device, Thru-Hole; 2 Leads; 0.3 in Pin Spacing
  R104-R107 R112-R115 R120-R123: Value: 330R
  R108-R111 R116-R119 R124-R127: Value: 1K

## Sheet 08-LogicNAND.SchDoc
size A4
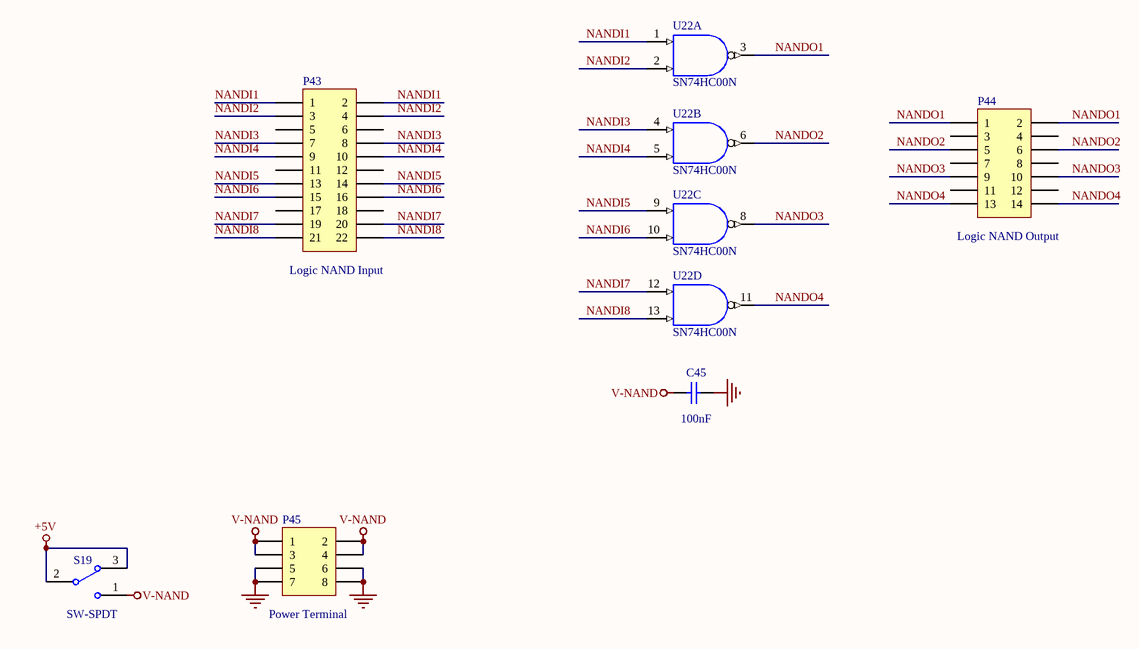
[diagram p12: 08-LogicNAND.SchDoc]

### Parts
C45  value 100nF  [C-0805]  (hidden comment: 104)
P43  value Logic NAND Input  [HDR2X11]  (hidden comment: Header 11X2)
P44  value Logic NAND Output  [HDR2X7]  (hidden comment: H7X2)
P45  Publisher: Power Terminal  [HDR2X4]  (hidden comment: Header 4X2)
S19  SW-SPDT  [SW-DIP1SMD]
U22  SN74HC00N  [SK-DIP14-300]  (parts A,B,C,D of 4)

### Nets
+5V: S19.2 S19.3
GND: C45.2 P45.5 P45.6 P45.7 P45.8 U22.7(GND)
V-NAND: C45.1 P45.1 P45.2 P45.3 P45.4 S19.1
VCC: U22.14(V-NAND)
NANDI1: P43.1 P43.2 U22.1(A)
NANDI2: P43.3 P43.4 U22.2(B)
NANDI3: P43.7 P43.8 U22.4(A)
NANDI4: P43.9 P43.10 U22.5(B)
NANDI5: P43.13 P43.14 U22.9(A)
NANDI6: P43.15 P43.16 U22.10(B)
NANDI7: P43.19 P43.20 U22.12(A)
NANDI8: P43.21 P43.22 U22.13(B)
NANDO1: P44.1 P44.2 U22.3(Y)
NANDO2: P44.5 P44.6 U22.6(Y)
NANDO3: P44.9 P44.10 U22.8(Y)
NANDO4: P44.13 P44.14 U22.11(Y)

Not connected (* = marked no-connect by the designer): P43 5 6 11 12 17 18; P44 3 4 7 8 11 12

### Library data of the parts
C45 = Cap: Capacitor; Published: 8-Jun-2000; LatestRevisionDate: 17-Jul-2002; LatestRevisionNote: Re-released for DXP Platform.; PackageReference: RAD-0.3; Publisher: Altium Limited; PackageDescription: Radial Cap, Thru-Hole; 2 Leads; 0.3 in Pin Spacing
P43 = Header 11X2: Header, 11-Pin, Dual row; LatestRevisionDate: 17-Jul-2002; LatestRevisionNote: Re-released for DXP Platform.
P44 = Header 7X2: Header, 7-Pin, Dual row; LatestRevisionDate: 17-Jul-2002; LatestRevisionNote: Re-released for DXP Platform.
P45 = Header 4X2: Header, 4-Pin, Dual row; LatestRevisionDate: 17-Jul-2002; LatestRevisionNote: Re-released for DXP Platform.
S19 = SW-SPDT: as S10 on sheet 02-PowerSupply; Published: 24-Mar-1999; LatestRevisionDate: 17-Dec-2003; LatestRevisionNote: Schematic revised, PCB Footprint replaced.; DatasheetVersion: 05-Dec-2000; PackageReference: TL36WW15050; Publisher: Altium Limited; PackageDescription: Switch; 4 Leads; ComponentLink1Description: Manufacturer Link; ComponentLink1URL: http://www.apem.com
U22 = SN74HC00N: Quadruple 2-Input Positive-NAND Gate; Published: 8-Jun-2000; LatestRevisionDate: 04-Mar-2005; LatestRevisionNote: Stylized 3D Model Added.; DatasheetVersion: May-1997; PackageVersion: Oct-1995; PackageReference: N014; Publisher: Altium Limited; PackageDescription: DIP; 14 Leads; Row Spacing 7.62 mm; Pitch 2.54 mm; ComponentLink1Description: Manufacturer Link; ComponentLink1URL: http://www.ti.com/; ComponentLink2Description: Datasheet; ComponentLink2URL: http://www-s.ti.com/sc/ds/sn74hc00.pdf